# EAGLE design lisa_m (EAGLE 7.6.0)

## Sheet 1 of 2
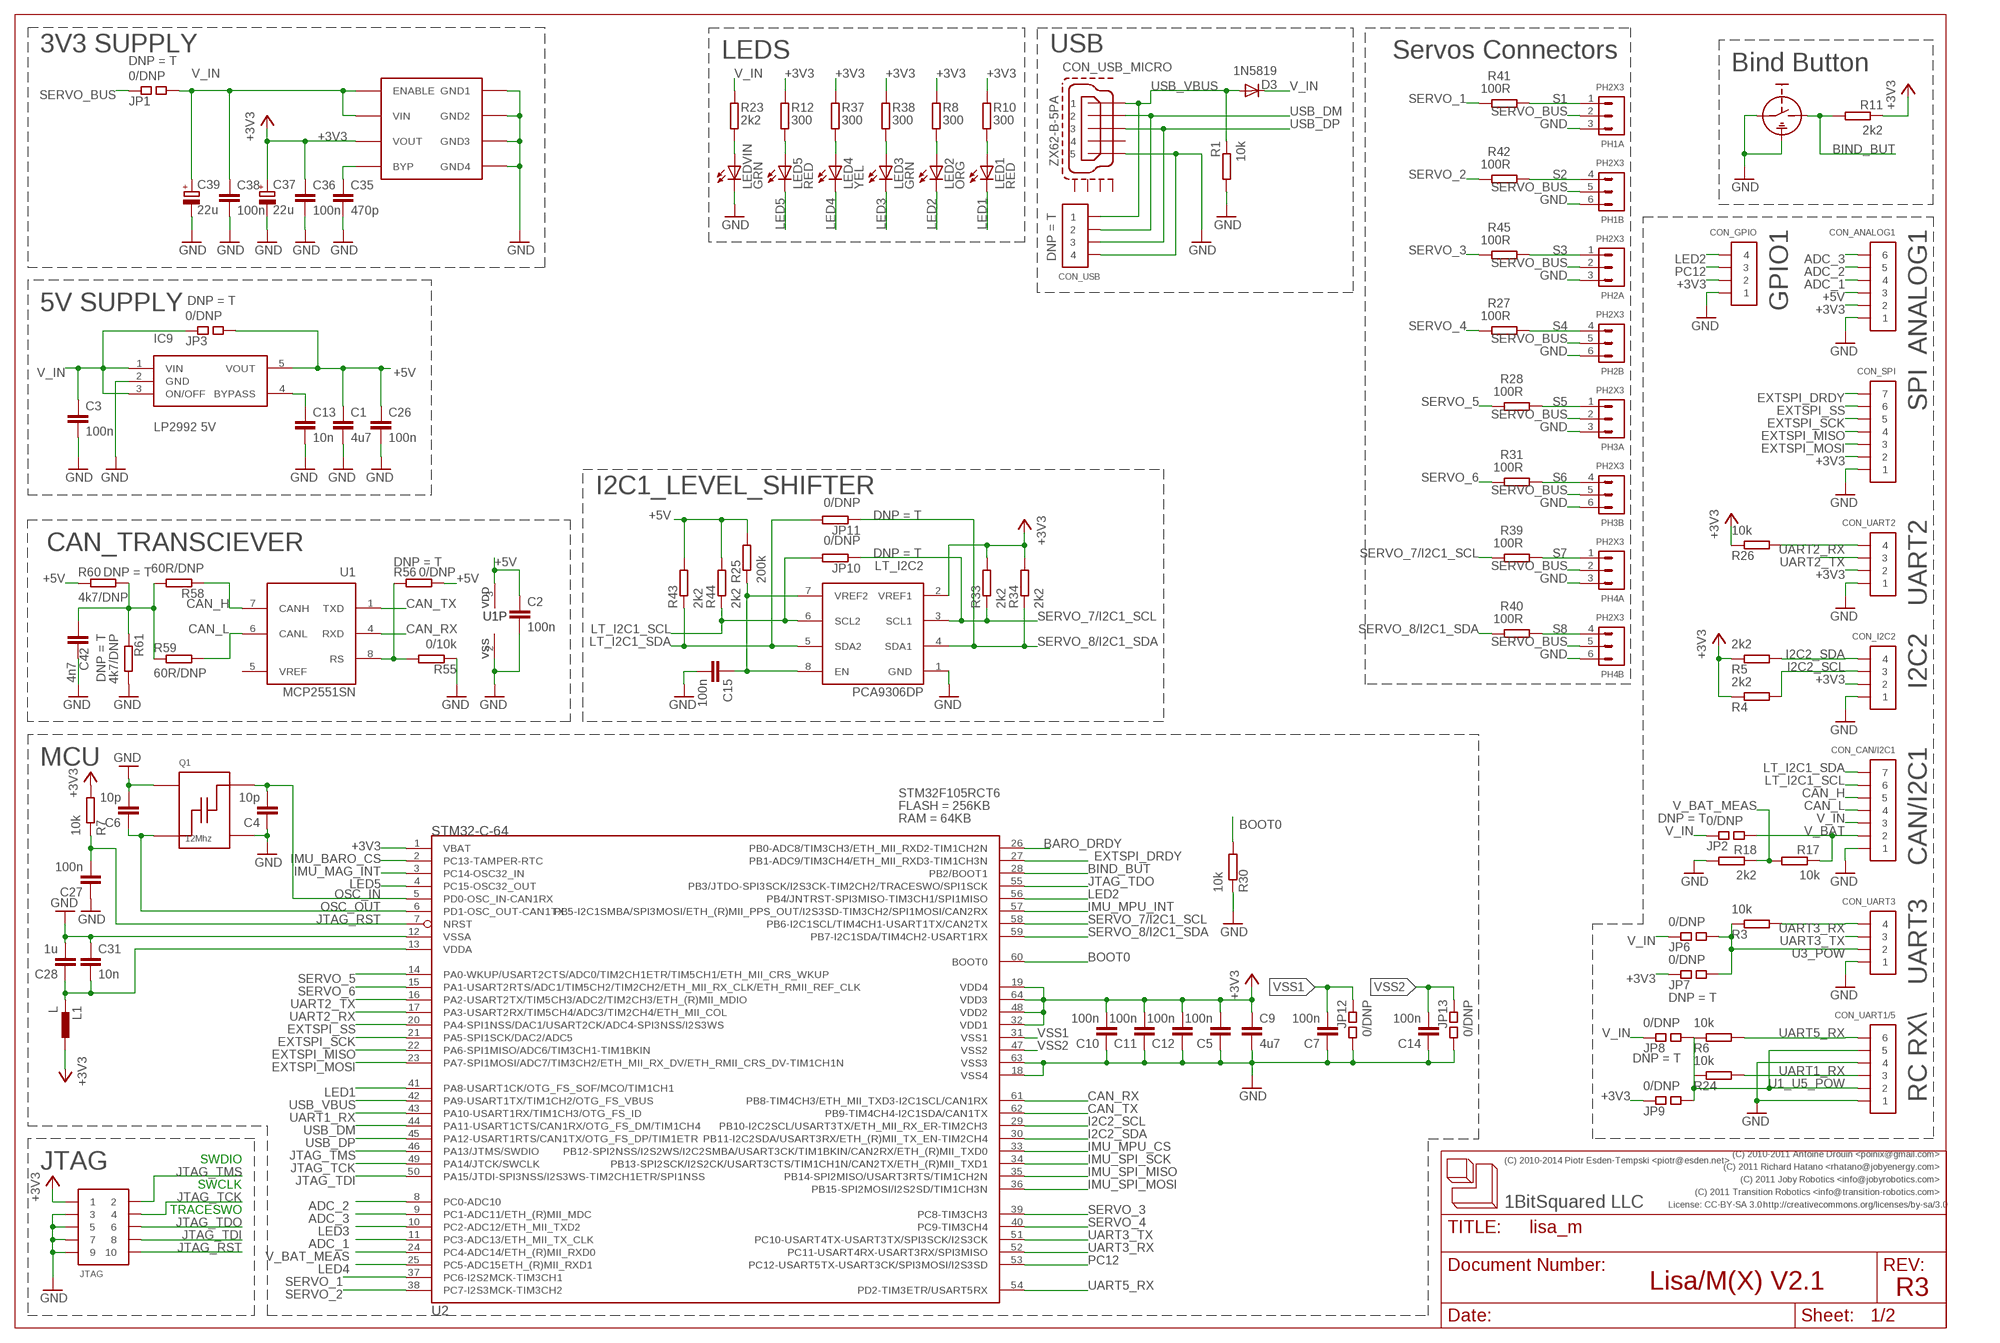
[diagram p0: schematic, sheet 1]

### Parts
C1  4u7  CAPACITOR-0603  [0603-CAP]
C2  100n  CAPACITOR-0402  [0402-CAP]
C3  100n  CAPACITOR-0402  [0402-CAP]
C4  10p  CAPACITOR-0402  [0402-CAP]
C5  100n  CAPACITOR-0402  [0402-CAP]
C6  10p  CAPACITOR-0402  [0402-CAP]
C7  100n  CAPACITOR-0402  [0402-CAP]
C9  4u7  CAPACITOR-0603  [0603-CAP]
C10  100n  CAPACITOR-0402  [0402-CAP]
C11  100n  CAPACITOR-0402  [0402-CAP]
C12  100n  CAPACITOR-0402  [0402-CAP]
C13  10n  CAPACITOR-0402  [0402-CAP]
C14  100n  CAPACITOR-0402  [0402-CAP]
C15  100n  CAPACITOR-0402  [0402-CAP]
C26  100n  CAPACITOR-0402  [0402-CAP]
C27  100n  CAPACITOR-0402  [0402-CAP]
C28  1u  CAPACITOR-0603  [0603-CAP]
C31  10n  CAPACITOR-0402  [0402-CAP]
C35  470p  CAPACITOR-0402  [0402-CAP]
C36  100n  CAPACITOR-0402  [0402-CAP]
C37  22u  CAPACITOR-POLB  [3528/B]
C38  100n  CAPACITOR-0402  [0402-CAP]
C39  22u  CAPACITOR-POLB  [3528/B]
C42  4n7  CAPACITOR-0603  [0603-CAP]
CON_ANALOG1  CONN_6-1-53398  [PB-53398-06]
CON_CAN/I2C1  CONN_7-1-53398  [PB-53398-07]
CON_GPIO  CONN_4-1-53398  [PB-53398-04]
CON_I2C2  CONN_4-1-53398  [PB-53398-04]
CON_SPI  CONN_7-1-53398  [PB-53398-07]
CON_UART1/5  CONN_6-1PB-53398-06_SMALL  [PB-53398-06]
CON_UART2  CONN_4-1-53398  [PB-53398-04]
CON_UART3  CONN_4-1-53398  [PB-53398-04]
CON_USB  CONN_4-1-53047  [PB-53047-04]
CON_USB_MICRO  ZX62-B-5PA  [ZX62-B-5PA]
D3  1N5819  DIODE-0603  [0603-DIO]
IC9  LP2992 5V  LP2992  [SOT23-5]
JP1  0/DNP  SQ_JMP-0402  [0402-SQJMP]
JP2  0/DNP  SQ_JMP-0402  [0402-SQJMP]
JP3  0/DNP  SQ_JMP-0402  [0402-SQJMP]
JP6  0/DNP  SQ_JMP-0402  [0402-SQJMP]
JP7  0/DNP  SQ_JMP-0402  [0402-SQJMP]
JP8  0/DNP  SQ_JMP-0402  [0402-SQJMP]
JP9  0/DNP  SQ_JMP-0402  [0402-SQJMP]
JP10  0/DNP  RESISTOR-0603  [0603-RES]
JP11  0/DNP  RESISTOR-0603  [0603-RES]
JP12  0/DNP  SQ_JMP-0402  [0402-SQJMP]
JP13  0/DNP  SQ_JMP-0402  [0402-SQJMP]
JTAG  PIN_HDR_EDG_1.27MM_5-2  CONN_5-2-FTSH-V  [FTSH-105-DV]
L1  L  INDUCTOR-0402  [0402-IND]
LED1  RED  LED-0402  [0402-LED]
LED2  ORG  LED-0402  [0402-LED]
LED3  GRN  LED-0402  [0402-LED]
LED4  YEL  LED-0402  [0402-LED]
LED5  RED  LED-0402  [0402-LED]
LEDVIN  GRN  LED-0402  [0402-LED]
LT_I2C2  PCA9306DP  [TSSOP_B3]
PH1  PH2X3  [PH010-2-3]
PH2  PH2X3  [PH010-2-3]
PH3  PH2X3  [PH010-2-3]
PH4  PH2X3  [PH010-2-3]
Q1  12Mhz  ABM8  [ABM8]
R1  10k  RESISTOR-0402  [0402-RES]
R3  10k  RESISTOR-0402  [0402-RES]
R4  2k2  RESISTOR-0402  [0402-RES]
R5  2k2  RESISTOR-0402  [0402-RES]
R6  10k  RESISTOR-0402  [0402-RES]
R7  10k  RESISTOR-0402  [0402-RES]
R8  300  RESISTOR-0402  [0402-RES]
R10  300  RESISTOR-0402  [0402-RES]
R11  2k2  RESISTOR-0402  [0402-RES]
R12  300  RESISTOR-0402  [0402-RES]
R17  10k  RESISTOR-0402  [0402-RES]
R18  2k2  RESISTOR-0402  [0402-RES]
R23  2k2  RESISTOR-0402  [0402-RES]
R24  10k  RESISTOR-0402  [0402-RES]
R25  200k  RESISTOR-0402  [0402-RES]
R26  10k  RESISTOR-0402  [0402-RES]
R27  100R  RESISTOR-0402  [0402-RES]
R28  100R  RESISTOR-0402  [0402-RES]
R30  10k  RESISTOR-0402  [0402-RES]
R31  100R  RESISTOR-0402  [0402-RES]
R33  2k2  RESISTOR-0402  [0402-RES]
R34  2k2  RESISTOR-0402  [0402-RES]
R37  300  RESISTOR-0402  [0402-RES]
R38  300  RESISTOR-0402  [0402-RES]
R39  100R  RESISTOR-0402  [0402-RES]
R40  100R  RESISTOR-0402  [0402-RES]
R41  100R  RESISTOR-0402  [0402-RES]
R42  100R  RESISTOR-0402  [0402-RES]
R43  2k2  RESISTOR-0402  [0402-RES]
R44  2k2  RESISTOR-0402  [0402-RES]
R45  100R  RESISTOR-0402  [0402-RES]
R55  0/10k  RESISTOR-0402  [0402-RES]
R56  0/DNP  RESISTOR-0402  [0402-RES]
R58  60R/DNP  RESISTOR-0402  [0402-RES]
R59  60R/DNP  RESISTOR-0402  [0402-RES]
R60  4k7/DNP  RESISTOR-0402  [0402-RES]
R61  4k7/DNP  RESISTOR-0402  [0402-RES]
SW1  MICROTACT_GND  [MICROTACT_GND]
U1  MCP2551SN  [SO-08]
U2  STM32-C-64  [LQFP64]
VREG1  MIC5209  [SOIC8]

### Nets
+3V3: C5.P$2 C9.P$1 C10.P$2 C11.P$2 C12.P$2 C36.P$1 C37.+ CON_ANALOG1.2 CON_GPIO.2 CON_I2C2.2 CON_SPI.2 CON_UART2.2 JP7.P$1 JP9.P$1 JTAG.1 L1.P$1 LT_I2C2.2(VREF1) R4.P$1 R5.P$1 R7.P$2 R8.P$2 R10.P$2 R11.P$1 R12.P$2 R26.P$1 R33.P$2 R34.P$2 R37.P$2 R38.P$2 U2.1(VBAT) U2.19(VDD4) U2.32(VDD1) U2.48(VDD2) U2.64(VDD3) VREG1.3(VOUT) ; also sheet 2
+5V: C1.P$1 C2.P$1 C26.P$1 CON_ANALOG1.3 IC9.5(VOUT) JP3.P$2 R25.P$2 R43.P$2 R44.P$2 R56.P$2 R60.P$1 U1.3(VDD)
ADC_1: CON_ANALOG1.4 U2.11(PC3-ADC13/ETH_MII_TX_CLK)
ADC_2: CON_ANALOG1.5 U2.8(PC0-ADC10)
ADC_3: CON_ANALOG1.6 U2.9(PC1-ADC11/ETH_(R)MII_MDC)
BARO_DRDY: U2.26(PB0-ADC8/TIM3CH3/ETH_MII_RXD2-TIM1CH2N)
BIND_BUT: R11.P$2 SW1.2 U2.28(PB2/BOOT1)
BOOT0: R30.P$2 U2.60(BOOT0)
CAN_CENTER: C42.P$2 R58.P$2 R59.P$1 R60.P$2 R61.P$1
CAN_H: CON_CAN/I2C1.5 R58.P$1 U1.7(CANH)
CAN_L: CON_CAN/I2C1.4 R59.P$2 U1.6(CANL)
CAN_RX: U1.4(RXD) U2.61(PB8-TIM4CH3/ETH_MII_TXD3-I2C1SCL/CAN1RX)
CAN_TX: U1.1(TXD) U2.62(PB9-TIM4CH4-I2C1SDA/CAN1TX)
EXTSPI_DRDY: CON_SPI.7 U2.27(PB1-ADC9/TIM3CH4/ETH_MII_RXD3-TIM1CH3N)
EXTSPI_MISO: CON_SPI.4 U2.22(PA6-SPI1MISO/ADC6/TIM3CH1-TIM1BKIN)
EXTSPI_MOSI: CON_SPI.3 U2.23(PA7-SPI1MOSI/ADC7/TIM3CH2/ETH_MII_RX_DV/ETH_RMII_CRS_DV-TIM1CH1N)
EXTSPI_SCK: CON_SPI.5 U2.21(PA5-SPI1SCK/DAC2/ADC5)
EXTSPI_SS: CON_SPI.6 U2.20(PA4-SPI1NSS/DAC1/USART2CK/ADC4-SPI3NSS/I2S3WS)
GND: C1.P$2 C2.P$2 C3.P$2 C4.P$1 C5.P$1 C6.P$2 C7.P$1 C9.P$2 C10.P$1 C11.P$1 C12.P$1 C13.P$2 C14.P$1 C15.P$2 C26.P$2 C27.P$1 C28.P$2 C31.P$1 C35.P$2 C36.P$2 C37.- C38.P$2 C39.- C42.P$1 CON_ANALOG1.1 CON_CAN/I2C1.1 CON_GPIO.1 CON_I2C2.1 CON_SPI.1 CON_UART1/5.1 CON_UART1/5.4 CON_UART2.1 CON_UART3.1 CON_USB.4 CON_USB_MICRO.PIN_5 IC9.2(GND) JP12.P$2 JP13.P$2 JTAG.3 JTAG.5 JTAG.7 JTAG.9 LEDVIN.C LT_I2C2.1(GND) PH1.3 PH1.6 PH2.3 PH2.6 PH3.3 PH3.6 PH4.3 PH4.6 Q1.P$2 Q1.P$4 R1.P$2 R18.P$2 R30.P$1 R55.P$1 R61.P$2 SW1.1 SW1.G(GND) U1.2(VSS) U2.12(VSSA) U2.18(VSS4) U2.63(VSS3) VREG1.5(GND4) VREG1.6(GND3) VREG1.7(GND2) VREG1.8(GND1) ; also sheet 2
I2C2_SCL: CON_I2C2.3 R4.P$2 U2.29(PB10-I2C2SCL/USART3TX/ETH_MII_RX_ER-TIM2CH3)
I2C2_SDA: CON_I2C2.4 R5.P$2 U2.30(PB11-I2C2SDA/USART3RX/ETH_(R)MII_TX_EN-TIM2CH4)
IMU_BARO_CS: U2.2(PC13-TAMPER-RTC) ; also sheet 2
IMU_MAG_INT: U2.3(PC14-OSC32_IN) ; also sheet 2
IMU_MPU_CS: U2.33(PB12-SPI2NSS/I2S2WS/I2C2SMBA/USART3CK/TIM1BKIN/CAN2RX/ETH_(R)MII_TXD0) ; also sheet 2
IMU_MPU_INT: U2.57(PB5-I2C1SMBA/SPI3MOSI/ETH_(R)MII_PPS_OUT/I2S3SD-TIM3CH2/SPI1MOSI/CAN2RX) ; also sheet 2
IMU_SPI_MISO: U2.35(PB14-SPI2MISO/USART3RTS/TIM1CH2N) ; also sheet 2
IMU_SPI_MOSI: U2.36(PB15-SPI2MOSI/I2S2SD/TIM1CH3N) ; also sheet 2
IMU_SPI_SCK: U2.34(PB13-SPI2SCK/I2S2CK/USART3CTS/TIM1CH1N/CAN2TX/ETH_(R)MII_TXD1) ; also sheet 2
JTAG_RST: C27.P$2 JTAG.10 R7.P$1 U2.7(NRST)
JTAG_TCK: JTAG.4 U2.49(PA14/JTCK/SWCLK)
JTAG_TDI: JTAG.8 U2.50(PA15/JTDI-SPI3NSS/I2S3WS-TIM2CH1ETR/SPI1NSS)
JTAG_TDO: JTAG.6 U2.55(PB3/JTDO-SPI3SCK/I2S3CK-TIM2CH2/TRACESWO/SPI1SCK)
JTAG_TMS: JTAG.2 U2.46(PA13/JTMS/SWDIO)
LED1: LED1.C U2.41(PA8-USART1CK/OTG_FS_SOF/MCO/TIM1CH1)
LED2: CON_GPIO.4 LED2.C U2.56(PB4/JNTRST-SPI3MISO-TIM3CH1/SPI1MISO)
LED3: LED3.C U2.10(PC2-ADC12/ETH_MII_TXD2)
LED4: LED4.C U2.25(PC5-ADC15ETH_(R)MII_RXD1)
LED5: LED5.C U2.4(PC15-OSC32_OUT)
LT_I2C1_SCL: CON_CAN/I2C1.6 JP10.P$2 LT_I2C2.6(SCL2) R44.P$1
LT_I2C1_SDA: CON_CAN/I2C1.7 JP11.P$2 LT_I2C2.5(SDA2) R43.P$1
N$1: R55.P$2 R56.P$1 U1.8(RS)
N$4: LED1.A R10.P$1
N$6: C13.P$1 IC9.4(BYPASS)
N$7: C35.P$1 VREG1.4(BYP)
N$8: C15.P$1 LT_I2C2.7(VREF2) LT_I2C2.8(EN) R25.P$1
N$10: LED2.A R8.P$1
N$12: LEDVIN.A R23.P$1
N$13: LED5.A R12.P$1
N$14: LED4.A R37.P$1
N$15: LED3.A R38.P$1
OSC_IN: C4.P$2 Q1.P$3 U2.5(PD0-OSC_IN-CAN1RX)
OSC_OUT: C6.P$1 Q1.P$1 U2.6(PD1-OSC_OUT-CAN1TX)
PC12: CON_GPIO.3 U2.53(PC12-USART5TX-USART3CK/SPI3MOSI/I2S3SD)
S1: PH1.1 R41.P$1
S2: PH1.4 R42.P$1
S3: PH2.1 R45.P$1
S4: PH2.4 R27.P$1
S5: PH3.1 R28.P$1
S6: PH3.4 R31.P$1
S7: PH4.1 R39.P$1
S8: PH4.4 R40.P$1
SERVO_1: R41.P$2 U2.37(PC6-I2S2MCK-TIM3CH1)
SERVO_2: R42.P$2 U2.38(PC7-I2S3MCK-TIM3CH2)
SERVO_3: R45.P$2 U2.39(PC8-TIM3CH3)
SERVO_4: R27.P$2 U2.40(PC9-TIM3CH4)
SERVO_5: R28.P$2 U2.14(PA0-WKUP/USART2CTS/ADC0/TIM2CH1ETR/TIM5CH1/ETH_MII_CRS_WKUP)
SERVO_6: R31.P$2 U2.15(PA1-USART2RTS/ADC1/TIM5CH2/TIM2CH2/ETH_MII_RX_CLK/ETH_RMII_REF_CLK)
SERVO_7/I2C1_SCL: JP10.P$1 LT_I2C2.3(SCL1) R33.P$1 R39.P$2 U2.58(PB6-I2C1SCL/TIM4CH1-USART1TX/CAN2TX)
SERVO_8/I2C1_SDA: JP11.P$1 LT_I2C2.4(SDA1) R34.P$1 R40.P$2 U2.59(PB7-I2C1SDA/TIM4CH2-USART1RX)
SERVO_BUS: JP1.P$1 PH1.2 PH1.5 PH2.2 PH2.5 PH3.2 PH3.5 PH4.2 PH4.5
U1_U5_POW: CON_UART1/5.2 CON_UART1/5.5 JP8.P$2 JP9.P$2 R6.P$1 R24.P$1
U3_POW: CON_UART3.2 JP6.P$2 JP7.P$2 R3.P$1
UART1_RX: CON_UART1/5.3 R24.P$2 U2.43(PA10-USART1RX/TIM1CH3/OTG_FS_ID)
UART2_RX: CON_UART2.4 R26.P$2 U2.17(PA3-USART2RX/TIM5CH4/ADC3/TIM2CH4/ETH_MII_COL)
UART2_TX: CON_UART2.3 U2.16(PA2-USART2TX/TIM5CH3/ADC2/TIM2CH3/ETH_(R)MII_MDIO)
UART3_RX: CON_UART3.4 R3.P$2 U2.52(PC11-USART4RX-USART3RX/SPI3MISO)
UART3_TX: CON_UART3.3 U2.51(PC10-USART4TX-USART3TX/SPI3SCK/I2S3CK)
UART5_RX: CON_UART1/5.6 R6.P$2 U2.54(PD2-TIM3ETR/USART5RX)
USB_DM: CON_USB.2 CON_USB_MICRO.PIN_2 U2.44(PA11-USART1CTS/CAN1RX/OTG_FS_DM/TIM1CH4)
USB_DP: CON_USB.3 CON_USB_MICRO.PIN_3 U2.45(PA12-USART1RTS/CAN1TX/OTG_FS_DP/TIM1ETR)
USB_VBUS: CON_USB.1 CON_USB_MICRO.PIN_1 D3.A R1.P$1 U2.42(PA9-USART1TX/TIM1CH2/OTG_FS_VBUS)
V_BAT: CON_CAN/I2C1.2 JP2.P$2 R17.P$1
V_BAT_MEAS: R17.P$2 R18.P$1 U2.24(PC4-ADC14/ETH_(R)MII_RXD0)
V_IN: C3.P$1 C38.P$1 C39.+ CON_CAN/I2C1.3 D3.C IC9.1(VIN) IC9.3(ON/OFF) JP1.P$2 JP2.P$1 JP3.P$1 JP6.P$1 JP8.P$1 R23.P$2 VREG1.1(ENABLE) VREG1.2(VIN) ; also sheet 2
VDDA: C28.P$1 C31.P$2 L1.P$2 U2.13(VDDA)
VSS1: C7.P$2 JP12.P$1 U2.31(VSS1)
VSS2: C14.P$2 JP13.P$1 U2.47(VSS2)
Unconnected: CON_USB_MICRO.GND_LEFT(S1) CON_USB_MICRO.GND_RIGHT(S2) CON_USB_MICRO.GND_UP_LEFT(S3) CON_USB_MICRO.GND_UP_RIGHT(S4) CON_USB_MICRO.PIN_4

### Notes on the sheet
- 3V3 SUPPLY | LEDS | USB | Servos Connectors
- Bind Button
- GPIO1 | ANALOG1
- 5V SUPPLY
- SPI
- I2C1_LEVEL_SHIFTER
- UART2
- CAN_TRANSCIEVER
- I2C2
- MCU | CAN/I2C1
- UART3
- RC RX\
- JTAG | (C) 2010-2011 Antoine Drouin <poinix@gmail.com>
- (C) 2010-2014 Piotr Esden-Tempski <piotr@esden.net>
- SWDIO | (C) 2011 Richard Hatano <rhatano@jobyenergy.com>
- (C) 2011 Joby Robotics <info@jobyrobotics.com>
- SWCLK | (C) 2011 Transition Robotics <info@transition-robotics.com>
- License: CC-BY-SA 3.0 | http://creativecommons.org/licenses/by-sa/3.0
- 1BitSquared LLC
- TRACESWO
- Lisa/M(X) V2.1 | R3

## Sheet 2 of 2
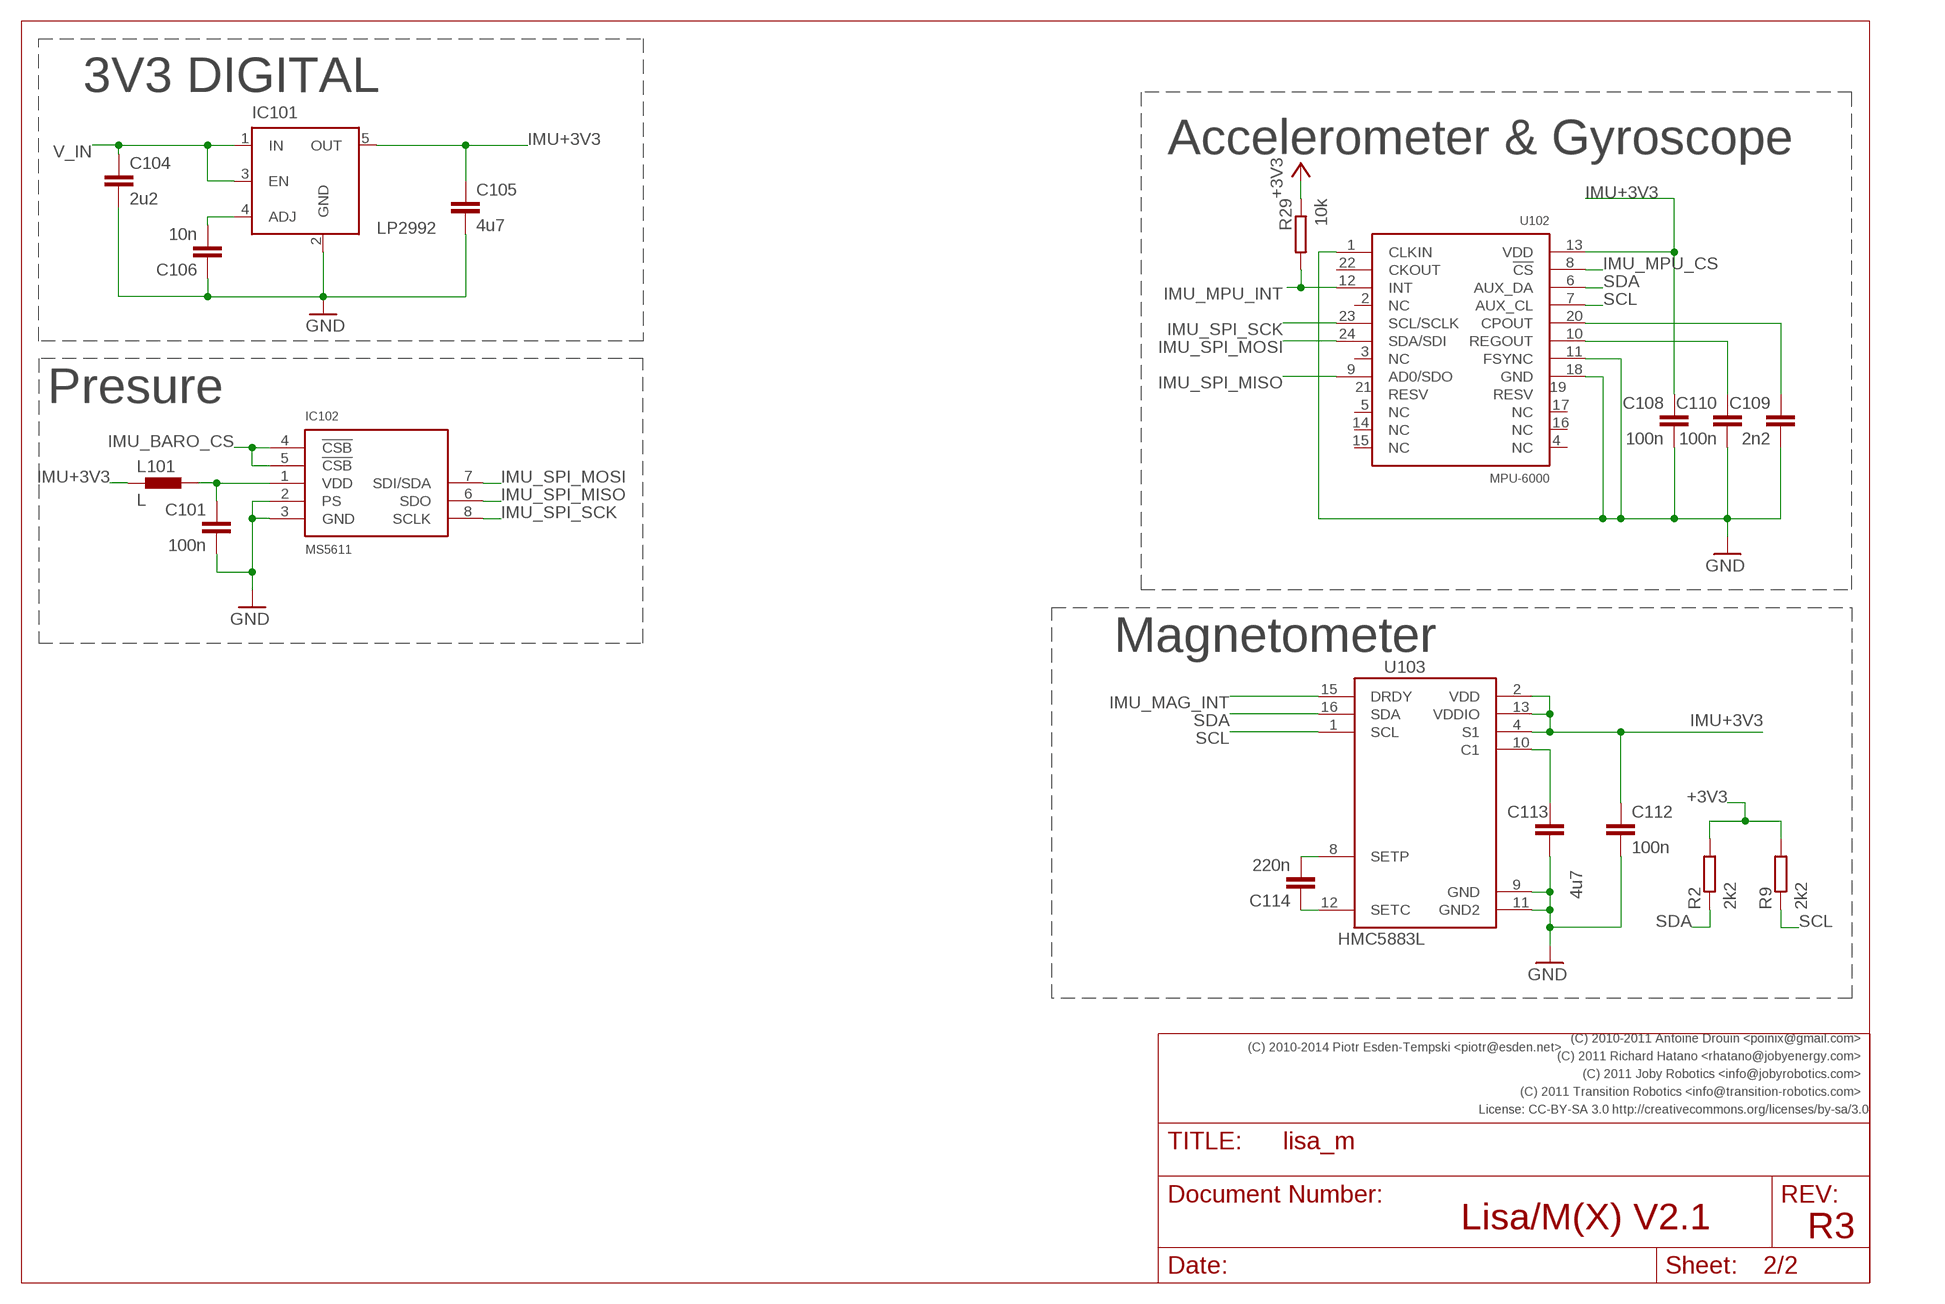
[diagram p1: schematic, sheet 2]

### Parts
C101  100n  CAPACITOR-0402  [0402-CAP]
C104  2u2  CAPACITOR-0603  [0603-CAP]
C105  4u7  CAPACITOR-0603  [0603-CAP]
C106  10n  CAPACITOR-0402  [0402-CAP]
C108  100n  CAPACITOR-0402  [0402-CAP]
C109  2n2  CAPACITOR-0402  [0402-CAP]
C110  100n  CAPACITOR-0402  [0402-CAP]
C112  100n  CAPACITOR-0402  [0402-CAP]
C113  4u7  CAPACITOR-0603  [0603-CAP]
C114  220n  CAPACITOR-0603  [0603-CAP]
IC101  LP2992  MIC5219BM5  [SOT23-5]
IC102  MS5611  [QFN-MS5611]
L101  L  INDUCTOR-0402  [0402-IND]
R2  2k2  RESISTOR-0402  [0402-RES]
R9  2k2  RESISTOR-0402  [0402-RES]
R29  10k  RESISTOR-0402  [0402-RES]
U102  MPU-6000  [QFN24-NO-PAD]
U103  HMC5883L  [LPCC16-HMC5883L]

### Nets
+3V3: R2.P$2 R9.P$2 R29.P$1 ; also sheet 1
BARO_+3V3: C101.P$1 IC102.1(VDD) L101.P$1
GND: C101.P$2 C104.P$2 C105.P$2 C106.P$1 C108.P$2 C109.P$2 C110.P$2 C112.P$2 C113.P$2 IC101.2(GND) IC102.2(PS) IC102.3(GND) U102.1(CLKIN) U102.11(FSYNC) U102.18(GND) U103.9(GND) U103.11(GND2) ; also sheet 1
IMU+3V3: C105.P$1 C108.P$1 C112.P$1 IC101.5(OUT) L101.P$2 U102.13(VDD) U103.2(VDD) U103.4(S1) U103.13(VDDIO)
IMU_BARO_CS: IC102.4(!CSB) IC102.5(!CSB) ; also sheet 1
IMU_MAG_INT: U103.15(DRDY) ; also sheet 1
IMU_MPU_CS: U102.8(!CS) ; also sheet 1
IMU_MPU_INT: R29.P$2 U102.12(INT) ; also sheet 1
IMU_SPI_MISO: IC102.6(SDO) U102.9(AD0/SDO) ; also sheet 1
IMU_SPI_MOSI: IC102.7(SDI/SDA) U102.24(SDA/SDI) ; also sheet 1
IMU_SPI_SCK: IC102.8(SCLK) U102.23(SCL/SCLK) ; also sheet 1
N$2: C109.P$1 U102.20(CPOUT)
N$3: C110.P$1 U102.10(REGOUT)
N$5: C113.P$1 U103.10(C1)
N$19: C106.P$2 IC101.4(ADJ)
N$34: C114.P$2 U103.8(SETP)
N$48: C114.P$1 U103.12(SETC)
SCL: R9.P$1 U102.7(AUX_CL) U103.1(SCL)
SDA: R2.P$1 U102.6(AUX_DA) U103.16(SDA)
V_IN: C104.P$1 IC101.1(IN) IC101.3(EN) ; also sheet 1
Unconnected: U102.2(NC) U102.3(NC) U102.4(NC) U102.5(NC) U102.14(NC) U102.15(NC) U102.16(NC) U102.17(NC) U102.19(RESV) U102.21(RESV) U102.22(CKOUT)

### Notes on the sheet
- 3V3 DIGITAL
- Accelerometer & Gyroscope
- Presure
- Magnetometer
- (C) 2010-2011 Antoine Drouin <poinix@gmail.com>
- (C) 2010-2014 Piotr Esden-Tempski <piotr@esden.net>
- (C) 2011 Richard Hatano <rhatano@jobyenergy.com>
- (C) 2011 Joby Robotics <info@jobyrobotics.com>
- (C) 2011 Transition Robotics <info@transition-robotics.com>
- License: CC-BY-SA 3.0 | http://creativecommons.org/licenses/by-sa/3.0
- Lisa/M(X) V2.1 | R3

## Power pins joined to a net without a drawn wire
VREF: U1.5(VREF)

## Library data of the parts
C1 C9 C105 C113 = pel_dipol_comp:CAPACITOR; PARTNO: cap-cer-0603-4u7
C2 C3 C5 C7 C10-C12 C14 C15 C26 C27 C36 C38 C101 C108 C110 C112 = pel_dipol_comp:CAPACITOR; PARTNO: cap-cer-0402-100n
C4 C6 = pel_dipol_comp:CAPACITOR; PARTNO: cap-cer-0402-10p
C13 C31 C106 = pel_dipol_comp:CAPACITOR; PARTNO: cap-cer-0402-10n
C28 = pel_dipol_comp:CAPACITOR; PARTNO: cap-cer-0603-1u
C35 = pel_dipol_comp:CAPACITOR; PARTNO: cap-cer-0402-470p
C37 C39 = pel_dipol_comp:CAPACITOR-POL; PARTNO: cap-tan-B-22u-16v
C42 = pel_dipol_comp:CAPACITOR; PARTNO: cap-cer-0603-4n7
C104 = pel_dipol_comp:CAPACITOR; PARTNO: cap-cer-0603-2u2
C109 = pel_dipol_comp:CAPACITOR; PARTNO: cap-cer-0402-2n2
C114 = pel_dipol_comp:CAPACITOR; PARTNO: cap-cer-0603-220n
CON_ANALOG1 = pel_molex:CONN_6-1; PARTNO: conn-picoblade-smd-0.05in-6-vert
CON_CAN/I2C1 CON_SPI = pel_molex:CONN_7-1; PARTNO: conn-picoblade-smd-0.05in-7-vert
CON_GPIO CON_I2C2 CON_UART2 CON_UART3 = pel_molex:CONN_4-1; PARTNO: conn-picoblade-smd-0.05in-4-vert
CON_UART1/5 = joby_robotics:CONN_6-1: molex con with reduced size landing pads to allow routing 6 mil tracks between them; PARTNO: conn-picoblade-smd-0.05in-6-vert
CON_USB = pel_molex:CONN_4-1; DNP: T; PARTNO: conn-picoblade-th-0.05in-4-vert
CON_USB_MICRO = open-bldc:ZX62-B-5PA; PARTNO: conn-smd-usb-micro-b
D3 = pel_dipol_comp:DIODE; PARTNO: diode-schottky-0603
IC9 = open-bldc:LP2992; PARTNO: vreg-sot-23-5-5v
IC101 = v-reg-micrel:MIC5219BM5: VOLTAGE REGULATOR; PARTNO: vreg-sot23-5-3v3
IC102 = aspirin:MS5611; PARTNO: ic-sensr-ms5611
JP1-JP3 JP7 JP8 = pel_jumpers:SQ_JMP; DNP: T; PARTNO: res-0402-0
JP6 JP9 JP12 JP13 = pel_jumpers:SQ_JMP; PARTNO: res-0402-0
JP10 JP11 = pel_dipol_comp:RESISTOR; DNP: T; PARTNO: res-0603-0
JTAG = pel_misc:CONN_5-2; PARTNO: conn-smd-0.05in-5-2
L1 L101 = pel_dipol_comp:INDUCTOR; PARTNO: ferrite-0402-600
LED1 = pel_dipol_comp:LED; PARTNO: led-0402-red
LED2 = pel_dipol_comp:LED; PARTNO: led-0402-org
LED3 LED5 LEDVIN = pel_dipol_comp:LED; PARTNO: led-0402-grn
LED4 = pel_dipol_comp:LED; PARTNO: led-0402-yel
LT_I2C2 = booz:PCA9306: Dual bidirectional I2C-bus and SMBus voltage-level translator; PARTNO: ic-tssop8-level-trans
PH1-PH4 = pel_hdr:PH2X3
Q1 = booz:ABM8; PARTNO: xtal-abm8-12mhz
R1 R3 R6 R7 R17 R24 R26 R29 R30 R55 = pel_dipol_comp:RESISTOR; PARTNO: res-0402-10k
R2 R4 R5 R9 R11 R18 R23 R33 R34 R43 R44 = pel_dipol_comp:RESISTOR; PARTNO: res-0402-2k2
R8 R10 R12 R37 R38 = pel_dipol_comp:RESISTOR; PARTNO: res-0402-300
R25 = pel_dipol_comp:RESISTOR; PARTNO: res-0402-200k
R27 R28 R31 R39-R42 R45 = pel_dipol_comp:RESISTOR; PARTNO: res-0402-100
R56 = pel_dipol_comp:RESISTOR; DNP: T; PARTNO: res-0402-0
R58 R59 = pel_dipol_comp:RESISTOR; PARTNO: res-0402-60.4
R60 R61 = pel_dipol_comp:RESISTOR; DNP: T; PARTNO: res-0402-4k7
SW1 = paparazzi:MICROTACT_GND; PARTNO: sw-tact-top-gnd-3.0-2.5
U1 = microchip_can:MCP2551: High Speed CAN tranceiver; PARTNO: ic-so8-can
U2 = pel_stm32:STM32-C-64; FLASH: 256KB; PARTNO: ic-mcu-stm32f415rgt6; PART_NR: STM32F105RCT6; RAM: 64KB
U102 = aspirin:MPU-6000; PARTNO: ic-sensr-mpu6000
U103 = aspirin:HMC5883L; PARTNO: ic-sensr-hmc5883l
VREG1 = paparazzi:MIC5209; PARTNO: vreg-so8-3v3

## Net classes
0 default: width 0.15 mm, drill 0.3 mm, clearance 0.15 mm

## Board
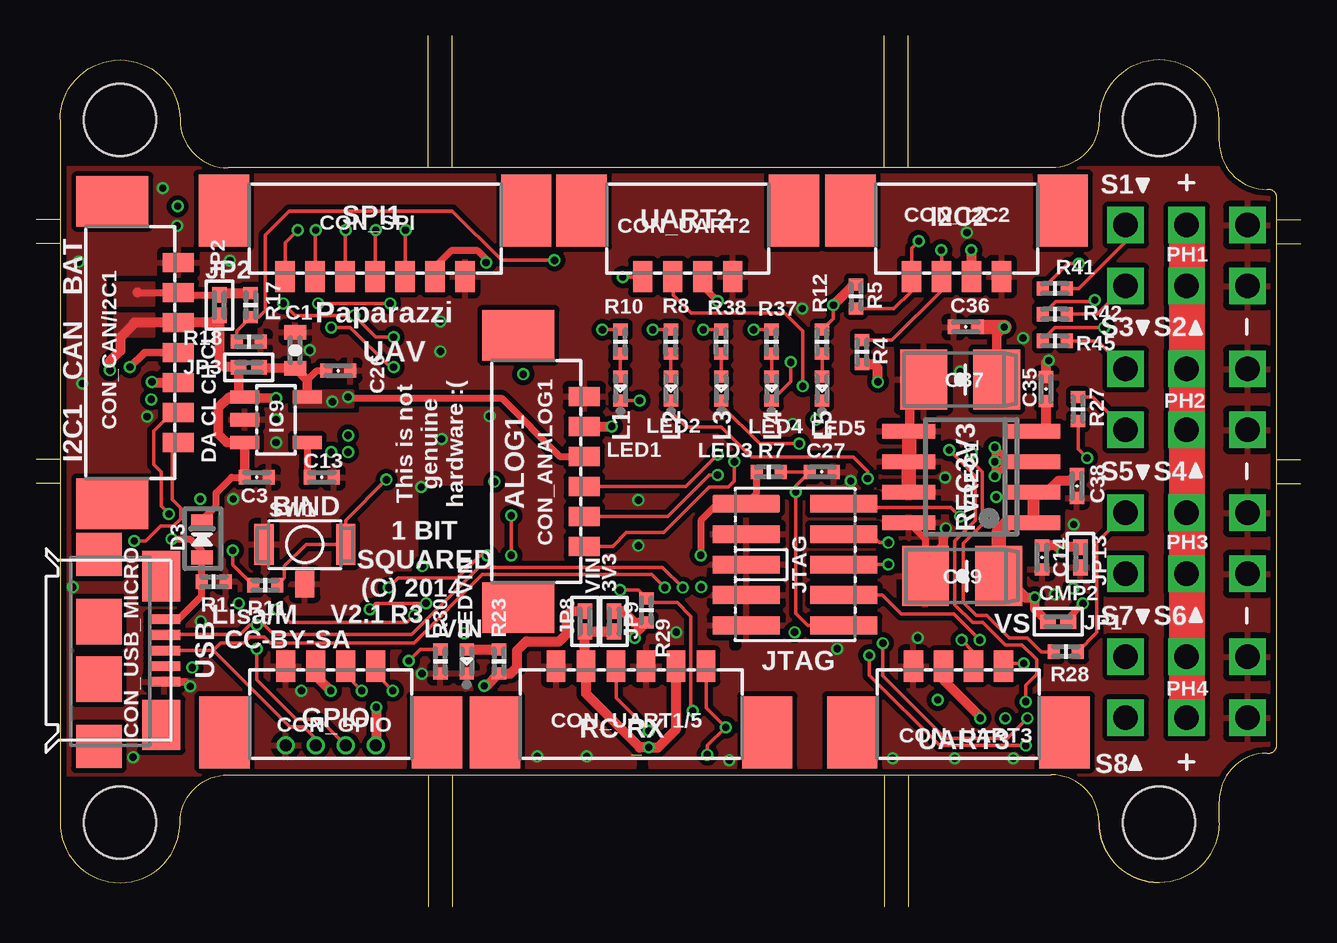
[diagram p2: board, top side]
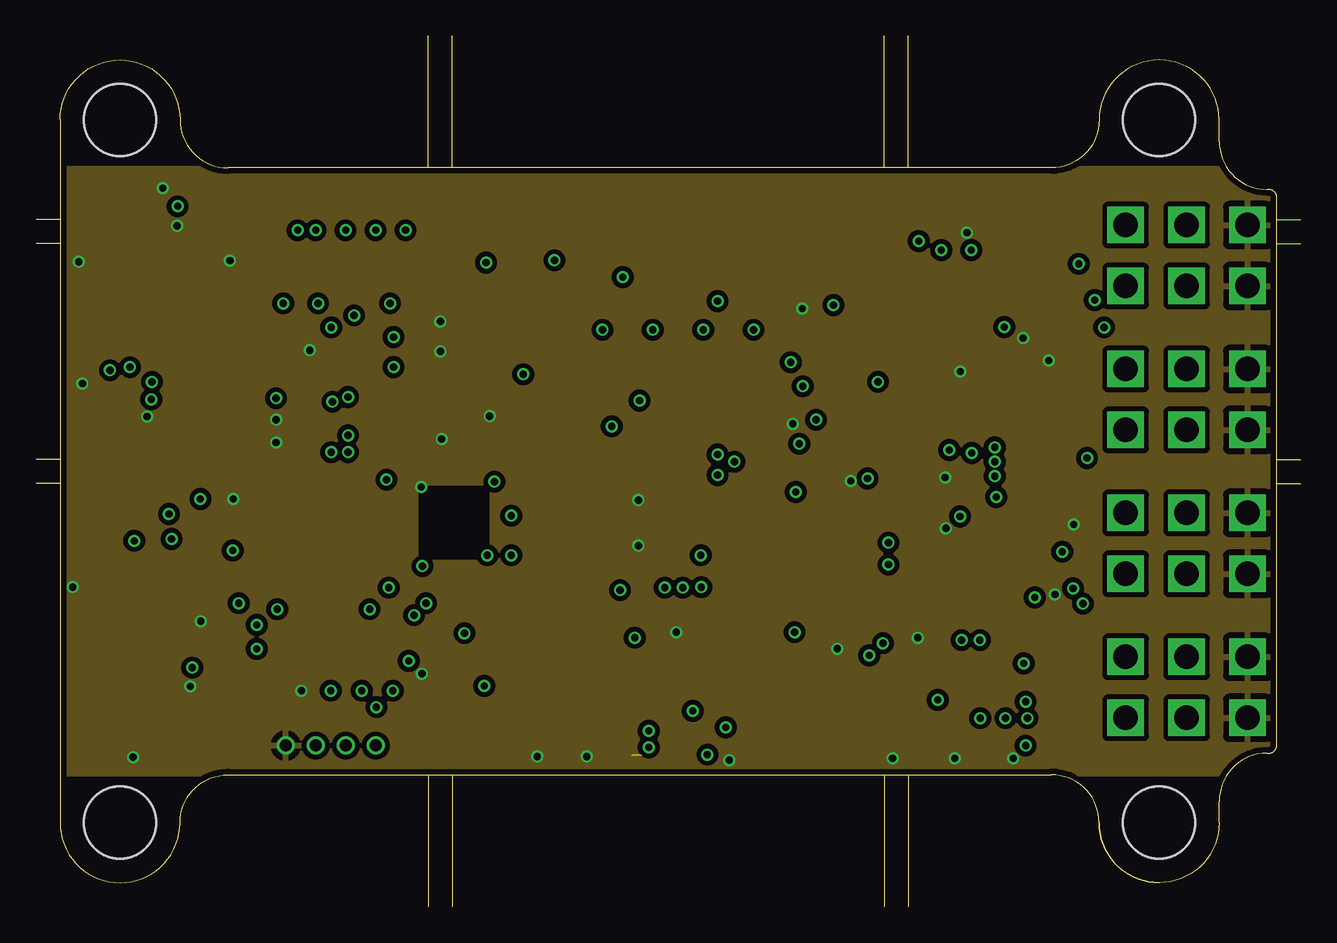
[diagram p3: board, inner layer Route2]
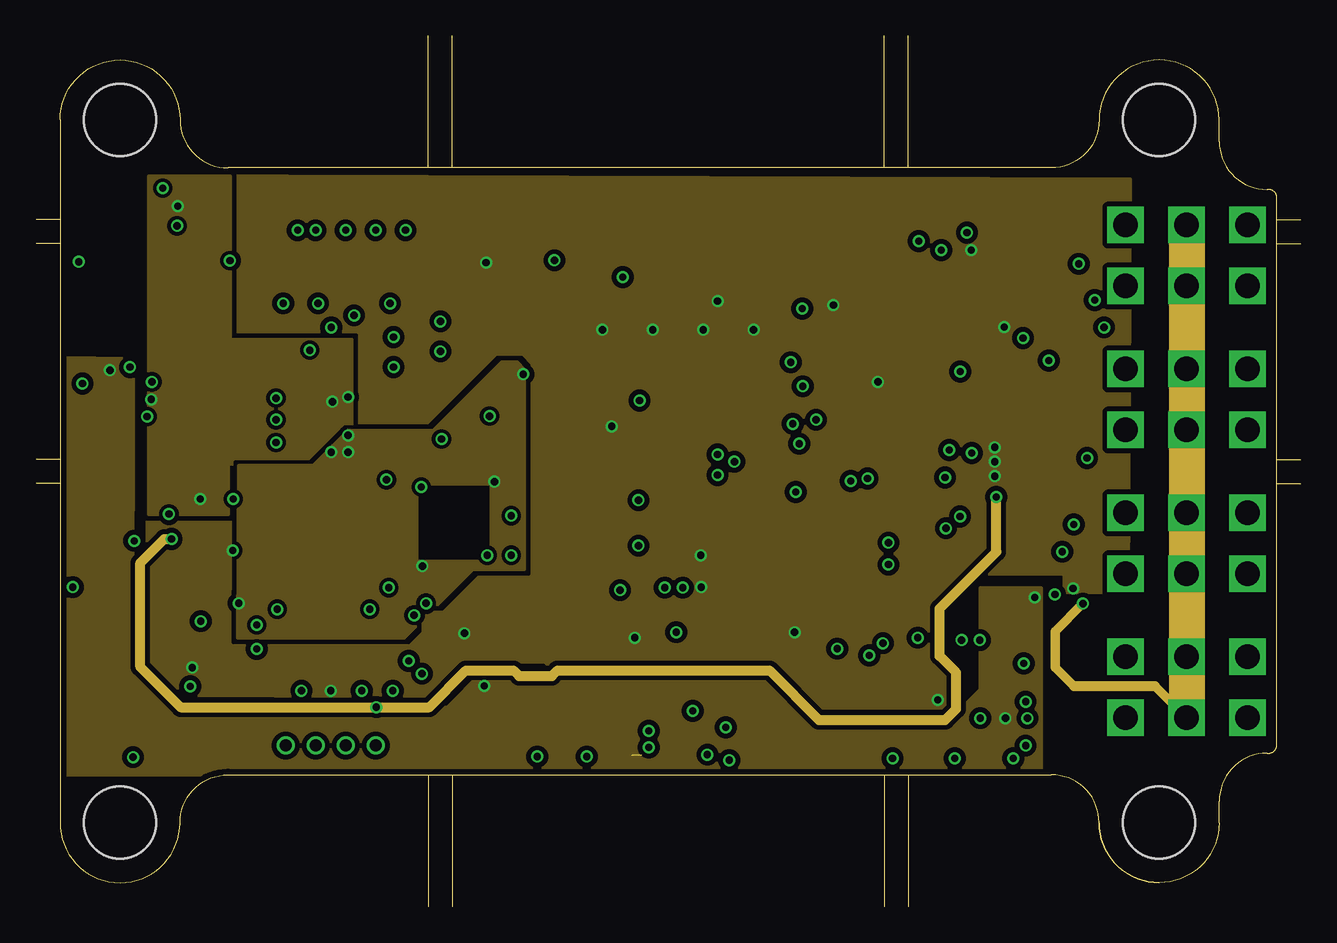
[diagram p4: board, inner layer Route15]
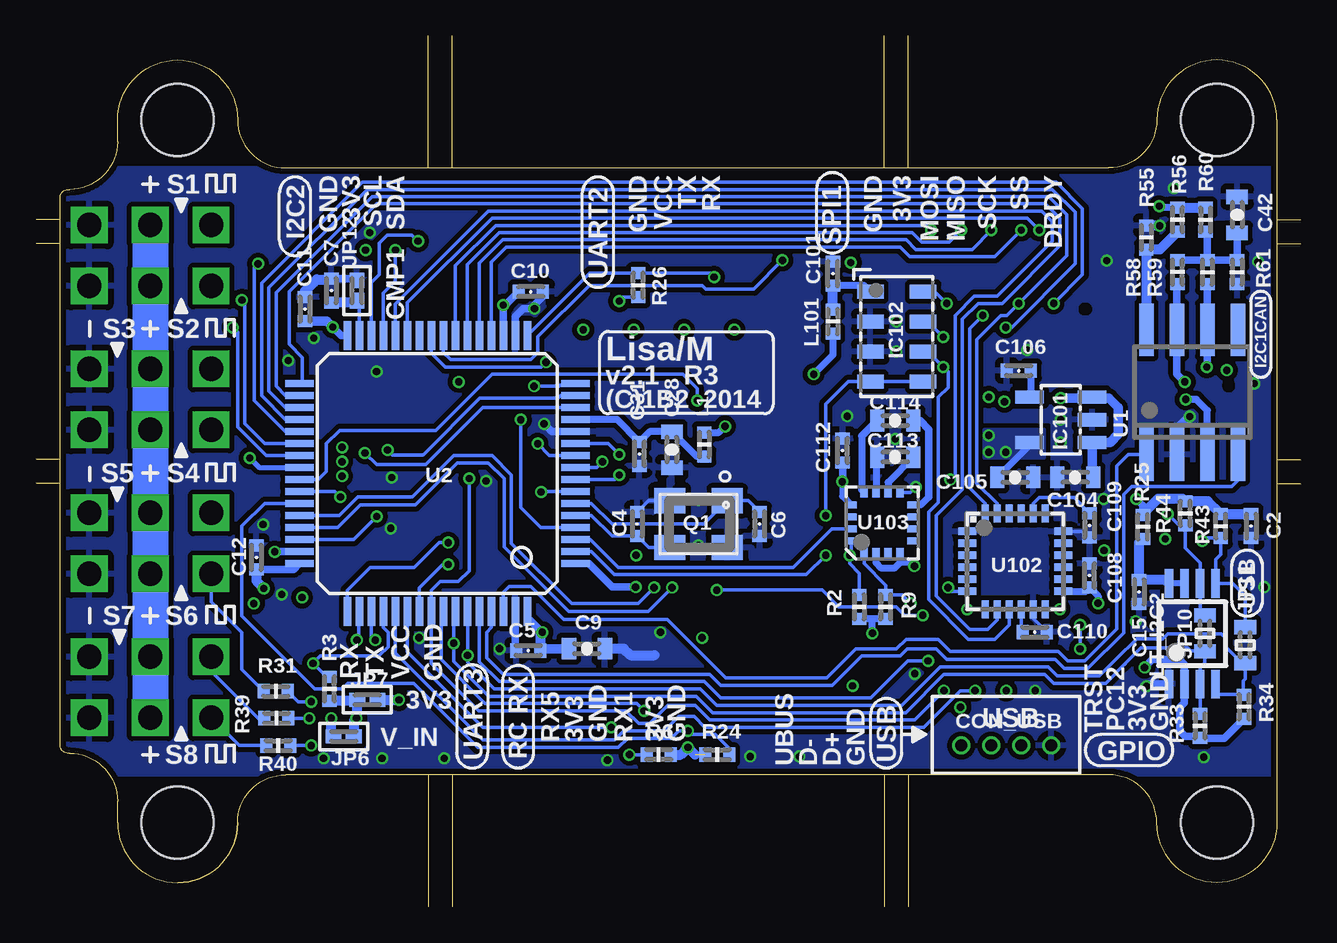
[diagram p5: board, bottom side, seen from below]

Size 50.7 x 34.3 mm. Coordinates in mm from the lower left corner, seen from the top.
Outline: 7,4.5 41.3,4.5 arc-90 43.3,2.5 arc90 45.8,0 arc90 48.3,2.5 48.3,3.4 arc-90 50.3,5.4 arc90 50.7,5.7 50.7,28.6 arc90 50.3,28.9 arc-90 48.3,30.9 48.3,31.8 arc90 45.8,34.3 arc90 43.3,31.8 arc-90 41.3,29.8 7,29.8 arc-90 5,31.8 arc90 2.5,34.3 arc90 0,31.8 0,2.5 arc90 2.5,0 arc90 5,2.5 arc-90 7,4.5
Copper layers (1*2+15*16): Top 0.035mm / dielectric 0.2mm / Route2 0.035mm / dielectric 1.5mm / Route15 0.035mm / dielectric 0.2mm / Bottom 0.035mm
Design rules "default": minimum track width 0.15mm, minimum drill 0.3mm, track to track 0.15mm, track to pad 0.15mm, pad to pad 0.15mm, via to via 0.15mm, smd to smd 0.15mm, copper to edge 10mil, drill to drill 8mil, minimum pad ring 0.1mm, minimum via ring 0.1mm, stop-mask expansion 14mil, vias tented up to drill 0.31mm, thermal gap 10mil
Holes 3 mm at 2.5,2.5 2.5,31.8 45.8,31.8 45.8,2.5
tKeepout: area 0.5,0.5 to 4.5,4.5; area 43.8,0.5 to 47.8,4.5; area 0.5,29.8 to 4.5,33.8; area 43.8,29.8 to 47.8,33.8
tRestrict: area 41.6,15.5 to 41.7,15.8; area 39.5,15.5 to 39.6,15.8; area 40.3,20.6 to 40.6,20.7; area 40.8,13.5 to 41.1,13.6; area 35.8,18.2 to 36.1,18.2; area 28.1,9.9 to 28.2,10.1; area 24.2,4.8 to 24.3,5.2
bRestrict: area 2.3,27.3 to 2.5,27.4; area 2,20.7 to 2.1,20.8; area 2.2,24.9 to 2.3,25; area 7.9,23.9 to 8.1,24; area 3.5,17.2 to 3.6,17.3; area 4.8,17.2 to 4.9,17.3; area 0.4,14.8 to 0.5,14.9; area 5.1,10.8 to 5.2,11; area 30.5,25.1 to 30.7,25.2; area 31.3,10.3 to 31.4,10.4; area 28.3,9.7 to 28.4,9.8
Milling: 46 lines

### Footprints (pad centres in the part's own frame; a part is rotated, then mirrored left to right if it is on the bottom)
0603-CAP = smd 0.6 x 0.9: P$1 -0.75,0; P$2 0.75,0
0402-CAP = smd 0.5 x 0.6: P$1 -0.5,0; P$2 0.5,0
3528/B = smd 1.95 x 2.5: + -1.525,0; - 1.525,0
PB-53398-06 = smd 0.8 x 1.3: 1 -3.125,1.25; 2 -1.875,1.25; 3 -0.625,1.25; 4 0.625,1.25; 5 1.875,1.25; 6 3.125,1.25 | smd 2.1 x 3: PAD1 -5.675,-1.5; PAD2 5.675,-1.5
PB-53398-07 = smd 0.8 x 1.3: 1 -3.75,1.25; 2 -2.5,1.25; 3 -1.25,1.25; 4 0,1.25; 5 1.25,1.25; 6 2.5,1.25; 7 3.75,1.25 | smd 2.1 x 3: PAD1 -6.3,-1.5; PAD2 6.3,-1.5
PB-53398-04 = smd 0.8 x 1.3: 1 -1.875,1.25; 2 -0.625,1.25; 3 0.625,1.25; 4 1.875,1.25 | smd 2.1 x 3: PAD1 -4.425,-1.5; PAD2 4.425,-1.5
PB-53398-06' = smd 0.775 x 1.3: 1 -3.125,1.25; 2 -1.875,1.25; 3 -0.625,1.25; 4 0.625,1.25; 5 1.875,1.25; 6 3.125,1.25 | smd 2.1 x 3: PAD1 -5.675,-1.5; PAD2 5.675,-1.5
PB-53047-04 = drill 0.5: 1 -1.875,0; 2 -0.625,0; 3 0.625,0; 4 1.875,0
ZX62-B-5PA = smd 1.8 x 1.9: GND_LEFT -4,0; GND_RIGHT 4,0 | smd 1.9 x 1.9: GND_MID_LEFT -1.2,0; GND_MID_RIGHT 1.2,0 | smd 2.1 x 1.6: GND_UP_LEFT -3.1,2.6; GND_UP_RIGHT 3.1,2.6 | smd 0.4 x 1.35: PIN_1 -1.3,2.725; PIN_2 -0.65,2.725; PIN_3 0,2.725; PIN_4 0.65,2.725; PIN_5 1.3,2.725
0603-DIO = smd 0.6 x 0.9: A 0.75,0; C -0.75,0
SOT23-5 = smd 0.55 x 1.2: 1 -0.95,-1.3; 2 0,-1.3; 3 0.95,-1.3; 4 0.95,1.3; 5 -0.95,1.3
QFN-MS5611 = smd 1.1 x 0.6: 1 -1.1,1.875; 2 -1.1,0.625; 3 -1.1,-0.625; 4 -1.1,-1.875; 5 1.1,-1.875; 6 1.1,-0.625; 7 1.1,0.625; 8 1.1,1.875
0402-SQJMP = smd 0.652 x 0.6: P$1 -0.424,0; P$2 0.424,0
0603-RES = smd 0.6 x 0.9: P$1 -0.75,0; P$2 0.75,0
FTSH-105-DV = smd 0.74 x 2.8: 1 -2.54,-2.03; 2 -2.54,2.03; 3 -1.27,-2.03; 4 -1.27,2.03; 5 0,-2.03; 6 0,2.03; 7 1.27,-2.03; 8 1.27,2.03; 9 2.54,-2.03; 10 2.54,2.03
0402-IND = smd 0.5 x 0.6: P$1 -0.5,0; P$2 0.5,0
0402-LED = smd 0.5 x 0.6: A -0.5,0; C 0.5,0
TSSOP_B3 = smd 1.2 x 0.35: 1 -2.925,0.975; 2 -2.925,0.325; 3 -2.925,-0.325; 4 -2.925,-0.975; 5 1.275,-0.975; 6 1.275,-0.325; 7 1.275,0.325; 8 1.275,0.975
PH010-2-3 = drill 1.016 square: 1 0,0; 2 2.54,0; 3 5.08,0; 4 0,-2.54; 5 2.54,-2.54; 6 5.08,-2.54
ABM8 = smd 1.3 x 1.05: P$1 -1.2,-0.975; P$2 1.2,-0.975; P$3 1.2,0.975; P$4 -1.2,0.975
0402-RES = smd 0.5 x 0.6: P$1 -0.5,0; P$2 0.5,0
MICROTACT_GND = smd 0.8 x 1.7: 1 -1.7,0; 2 1.7,0 | smd 0.8 x 1.1: G 0,-1.65
SO-08 = smd 0.6 x 2.2: 1 -1.905,-2.6; 2 -0.635,-2.6; 3 0.635,-2.6; 4 1.905,-2.6; 5 1.905,2.6; 6 0.635,2.6; 7 -0.635,2.6; 8 -1.905,2.6
LQFP64 = smd 1.2 x 0.3: 1 -5.75,3.75; 2 -5.75,3.25; 3 -5.75,2.75; 4 -5.75,2.25; 5 -5.75,1.75; 6 -5.75,1.25; 7 -5.75,0.75; 8 -5.75,0.25; 9 -5.75,-0.25; 10 -5.75,-0.75; 11 -5.75,-1.25; 12 -5.75,-1.75; 13 -5.75,-2.25; 14 -5.75,-2.75; 15 -5.75,-3.25; 16 -5.75,-3.75; 33 5.75,-3.75; 34 5.75,-3.25; 35 5.75,-2.75; 36 5.75,-2.25; 37 5.75,-1.75; 38 5.75,-1.25; 39 5.75,-0.75; 40 5.75,-0.25; 41 5.75,0.25; 42 5.75,0.75; 43 5.75,1.25; 44 5.75,1.75; 45 5.75,2.25; 46 5.75,2.75; 47 5.75,3.25; 48 5.75,3.75 | smd 0.3 x 1.2: 17 -3.75,-5.75; 18 -3.25,-5.75; 19 -2.75,-5.75; 20 -2.25,-5.75; 21 -1.75,-5.75; 22 -1.25,-5.75; 23 -0.75,-5.75; 24 -0.25,-5.75; 25 0.25,-5.75; 26 0.75,-5.75; 27 1.25,-5.75; 28 1.75,-5.75; 29 2.25,-5.75; 30 2.75,-5.75; 31 3.25,-5.75; 32 3.75,-5.75; 49 3.75,5.75; 50 3.25,5.75; 51 2.75,5.75; 52 2.25,5.75; 53 1.75,5.75; 54 1.25,5.75; 55 0.75,5.75; 56 0.25,5.75; 57 -0.25,5.75; 58 -0.75,5.75; 59 -1.25,5.75; 60 -1.75,5.75; 61 -2.25,5.75; 62 -2.75,5.75; 63 -3.25,5.75; 64 -3.75,5.75
QFN24-NO-PAD = smd 0.75 x 0.3: 1 -2,1.25; 2 -2,0.75; 3 -2,0.25; 4 -2,-0.25; 5 -2,-0.75; 6 -2,-1.25; 13 2,-1.25; 14 2,-0.75; 15 2,-0.25; 16 2,0.25; 17 2,0.75; 18 2,1.25 | smd 0.3 x 0.75: 7 -1.25,-2; 8 -0.75,-2; 9 -0.25,-2; 10 0.25,-2; 11 0.75,-2; 12 1.25,-2; 19 1.25,2; 20 0.75,2; 21 0.25,2; 22 -0.25,2; 23 -0.75,2; 24 -1.25,2
LPCC16-HMC5883L = smd 0.45 x 0.3: 1 -1.275,0.75; 2 -1.275,0.25; 3 -1.275,-0.25; 4 -1.275,-0.75; 9 1.275,-0.75; 10 1.275,-0.25; 11 1.275,0.25; 12 1.275,0.75 | smd 0.3 x 0.45: 5 -0.75,-1.275; 6 -0.25,-1.275; 7 0.25,-1.275; 8 0.75,-1.275; 13 0.75,1.275; 14 0.25,1.275; 15 -0.25,1.275; 16 -0.75,1.275
SOIC8 = smd 0.6 x 2.2: 1 -1.905,-2.6; 2 -0.635,-2.6; 3 0.635,-2.6; 4 1.905,-2.6; 5 1.905,2.6; 6 0.635,2.6; 7 -0.635,2.6; 8 -1.905,2.6

### Placement (x,y rotation side)
C1  9.8,22.2 90 top
C2  1.07,14.86 270 bottom
C3  8.2,16.9 0 top
C4  26.65,14.95 270 bottom
C5  31.19,9.68 0 bottom
C6  21.55,14.95 270 bottom
C7  39.4,24.69 270 bottom
C9  28.75,9.76 0 bottom
C10  31.08,24.64 180 bottom
C11  40.49,23.91 270 bottom
C12  42.52,13.57 270 bottom
C13  10.9,16.9 0 top
C14  40.92,13.57 90 top
C15  5.73,12.12 270 bottom
C26  11.6,21.35 0 top
C27  31.74,17.12 180 top
C28  25.21,18.06 270 bottom
C31  26.55,17.88 90 bottom
C35  41.09,20.58 90 top
C36  37.74,23.17 180 top
C37  37.51,20.98 180 top
C38  42.37,16.54 270 top
C39  37.59,12.78 180 top
C42  1.65,27.85 270 bottom
C101  18.5,25.4 90 bottom
C104  8.4,16.9 180 bottom
C105  10.9,16.9 0 bottom
C106  10.75,21.35 0 bottom
C108  7.8,12.8 90 bottom
C109  7.8,14.9 270 bottom
C110  10.08,10.45 0 bottom
C112  18.09,18.02 90 bottom
C113  15.9,17.74 180 bottom
C114  15.9,19.27 0 bottom
CON_ANALOG1  20.59,17.15 270 top
CON_CAN/I2C1  3.68,22.1 270 top
CON_GPIO  11.28,7.78 0 top
CON_I2C2  37.36,26.52 180 top
CON_SPI  13.13,26.52 180 top
CON_UART1/5  [PB-53398-06']  23.79,7.78 0 top
CON_UART2  26.16,26.52 180 top
CON_UART3  37.43,7.78 0 top
CON_USB  11.28,5.72 0 bottom
CON_USB_MICRO  1.62,9.68 270 top
D3  5.91,14.31 270 top
IC9  9,19.3 270 top
IC101  9,19.3 90 bottom
IC102  15.84,22.77 0 bottom
JP1  41.59,10.87 180 top
JP2  6.65,24.08 90 top
JP3  7.87,21.49 0 top
JP6  38.88,6.1 0 bottom
JP7  37.89,7.62 180 bottom
JP8  21.87,10.9 270 top
JP9  23.09,10.9 270 top
JP10  2.99,10.39 90 bottom
JP11  1.32,9.91 90 bottom
JP12  38.33,24.69 90 bottom
JP13  42.52,13.57 270 top
JTAG  30.63,13.26 270 top
L1  23.86,18.27 270 bottom
L101  18.5,23.4 270 bottom
LED1  23.35,20.6 270 top
LED2  25.45,20.6 270 top
LED3  27.55,20.6 270 top
LED4  29.65,20.6 270 top
LED5  31.75,20.6 270 top
LEDVIN  16.95,9.22 270 top
LT_I2C2  3.52,11.21 90 bottom
PH1  44.4,27.42 0 top
PH2  44.4,21.42 0 top
PH3  44.4,15.42 0 top
PH4  44.4,9.42 0 top
Q1  24.1,14.95 180 bottom
R1  6.4,12.55 0 top
R2  17.4,11.5 270 bottom
R3  39.47,8.08 90 bottom
R4  33.42,22.13 90 top
R5  33.17,24.44 270 top
R6  25.76,5.34 180 bottom
R7  29.53,17.12 180 top
R8  25.45,22.55 90 top
R9  16.3,11.5 270 bottom
R10  23.35,22.55 90 top
R11  8.55,12.4 0 top
R12  31.75,22.55 90 top
R17  7.94,24.08 270 top
R18  7.87,22.56 0 top
R23  18.29,9.22 270 top
R24  23.32,5.34 0 bottom
R25  5.58,14.84 90 bottom
R26  26.61,24.91 90 bottom
R27  42.42,19.74 270 top
R28  41.91,9.63 180 top
R29  24.43,11.36 90 top
R30  15.85,9.22 90 top
R31  41.71,7.98 0 bottom
R33  3.2,6.54 270 bottom
R34  1.37,7.34 270 bottom
R37  29.65,22.55 90 top
R38  27.55,22.55 90 top
R39  41.68,6.86 0 bottom
R40  41.61,5.72 0 bottom
R41  41.45,24.77 180 top
R42  41.45,23.7 180 top
R43  2.34,14.86 90 bottom
R44  3.81,15.4 90 bottom
R45  41.45,22.59 180 top
R55  5.44,26.9 270 bottom
R56  4.14,27.64 90 bottom
R58  4.14,25.46 90 bottom
R59  2.9,25.45 270 bottom
R60  2.97,27.63 270 bottom
R61  1.65,25.45 270 bottom
SW1  10.2,14.1 0 top
U1  3.52,20.45 0 bottom
U2  34.97,17.06 180 bottom
U102  10.9,13.4 0 bottom
U103  16.45,15 90 bottom
VREG1  37.97,16.92 90 top

### Tracks (layer width: path | path; a pad name or v marks a point on that pad's centre or on a via)
+3V3  (via drill 0.3)
  Top 0.15: R12.P$2 32.23,23.53 v32.23,24.08 | R37.P$2 v28.9,23.05 | R10.P$2 v22.6,23.05 | R8.P$2 v24.7,23.05 | R38.P$2 v26.8,23.05 | R11.P$1 7.2,13.25 v7.2,13.85
  Top 0.3: CON_SPI.2 15.63,25.68 16.3,26.35 17.4,26.35 17.75,26 v17.75,25.85 | CON_UART2.2 26.78,24.87 v27.4,24.25 | R7.P$2 29.03,16.24 JTAG.1 27.4,15.8 26.7,15.1 v26.7,13.65 | VREG1.3 v38.95,17.55 | VREG1.3 39.54,17.56 v38.95,18.15 v38.95,16.95 39.56,17.56 VREG1.3
  Top 0.4: C37.+ 39.03,22.86 v39.34,23.17
  Top 0.406: CON_ANALOG1.2 v22.99,19.02 v22.99,19.03 | CON_I2C2.2 37.98,26.35 v37.97,26.37 | R5.P$1 33.08,24.94 v32.23,24.08 | R4.P$1 33.9,21.63 34.06,21.47 34.06,20.9 v34.08,20.88 | CON_GPIO.2 10.65,8.63 v11.28,8 | v23.95,10.21 23.95,10.37 R29.P$1 23.93,10.85 23.45,11.32 JP9.P$1
  Top 0.61: C36.P$1 v39.34,23.17
  Bottom 0.15: R26.P$1 27.24,24.41 v27.4,24.25
  Bottom 0.3: R9.P$2 16.85,11 | 16.85,11 R2.P$2 | v16.85,10.4 16.85,11 | L1.P$1 23.25,18.77 v22.99,19.03
  Bottom 0.305: 40.67,13.31 U2.48 40.97,13.07 C12.P$2 | v5.51,8.97 5.18,9.3 4.04,9.3 3.85,9.11 LT_I2C2.2 3.85,7.51 4.04,7.32 4.04,6.33 3.81,6.1 3.26,6.1 R33.P$2 3.19,6.02 2.19,6.02 R34.P$2 | C10.P$2 32.14,24.08 v32.23,24.08 v32.22,24.09 U2.19 | U2.32 38.98,22.81 v39.34,23.17 39.35,23.16 | U2.1 28.68,13.31 27.69,12.32 v26.72,12.32 | U2.64 31.22,11.06 v30.61,10.44
  Bottom 0.4: C11.P$2 39.58,23.41 v39.34,23.17 | C9.P$1 30.61,9.76 C5.P$2
  Bottom 0.406: 39.35,23.16 39.36,23.16 | JP7.P$1 v36.58,7.62 | C5.P$2 30.69,10.37 v30.61,10.44 | C12.P$2 42.52,12.58 v42.21,12.27
  pour Route15 (isolate 0.203, rank 4): 16.38,7.75 5.21,7.8 3.63,9.38 3.65,29.48 44.6,29.34 44.6,28.73 44.52,12.09 41.83,12.09 41.83,12.88 37.89,12.86 37.89,8.26 36.82,7.29 31.52,7.29 29.46,9.33 25.15,9.33 23.37,7.55 21.84,7.55 20.19,9.2 17.78,9.2
+5V  (via drill 0.3)
  Top 0.3: CON_ANALOG1.3 20.83,17.77 18.4,20.2 12.05,20.2 v12,20.25 | 10.3,20.95 10.7,21.35 C26.P$1
  Top 0.4: JP3.P$2 8.34,21.45 C1.P$1 10.3,20.95 IC9.5
  Bottom 0.3: U1.3 2.89,19.69 3.35,20.15 v3.8,20.15 | R56.P$2 4.84,28.14 v4.9,28.2 | 5.58,15.38 5.58,15.73 v5.85,16
  Bottom 0.406: R60.P$1 4.13,28.13 R56.P$2 | C2.P$1 R43.P$2 2.87,15.9 R44.P$2 3.92,16.01 4.95,16.01 5.58,15.38 R25.P$2
  other vias: 11.35,20.05
  pour Route15 (rank 2): 3.7,29.45 3.7,15.35 7,15.35 7,17.45 12.15,17.45 12.15,22.65 7.1,22.65 7.1,29.45
  pour Top (no thermals): 12.2,20.5 12.2,19.85 9.75,19.85 9.75,20.5
ADC_1  (via drill 0.3)
  Top 0.15: CON_ANALOG1.4 26.07,16.52 v27.4,17.85
  Bottom 0.15: U2.11 27.86,18.31 v27.4,17.85
ADC_2  (via drill 0.3)
  Top 0.15: CON_ANALOG1.5 25.32,15.27 27.05,17 v27.4,17
  Bottom 0.15: U2.8 27.59,16.81 v27.4,17
ADC_3  (via drill 0.3)
  Top 0.15: v28.1,17.55 28.1,16.75 27.85,16.5 27.05,16.5 25.15,14.6 23.6,14.6 23.02,14.02 CON_ANALOG1.6
  Top 0.152: CON_ANALOG1.6 21.87,14
  Bottom 0.15: U2.9 28.34,17.31 v28.1,17.55
BARO_+3V3
  Bottom 0.3: IC102.1 17.2,24.9 C101.P$1
  Bottom 0.406: L101.P$1 C101.P$1
BIND_BUT  (via drill 0.3)
  Top 0.15: v13.6,16.8 11.9,15.1 SW1.2 10.25,14.1 9.35,13.2 9.35,12.7 R11.P$2
  Bottom 0.15: U2.28 36.72,24.13 32.85,28 9.8,28 9.35,27.55 9.35,26.75 11.65,24.45 12.6,24.45 13.4,23.65 13.4,17 v13.6,16.8
BOOT0  (via drill 0.3)
  Top 0.152: R30.P$2 15,9.72 v14.53,9.25
  Bottom 0.15: v14.53,9.25 15.37,9.25 16.92,7.7
  Bottom 0.152: U2.60 33.22,9.21 32.41,8.39 23.85,8.39 23.16,7.7 16.92,7.7
CAN_CENTER
  Bottom 0.305: R58.P$2 R59.P$1 | R59.P$1 2.9,27.06 R60.P$2 | R59.P$1 R61.P$1 C42.P$2
CAN_H  (via drill 0.3)
  Top 0.406: CON_CAN/I2C1.5 3.86,20.85 v3.83,20.88
  Bottom 0.305: v3.83,20.88 4.16,21.21 U1.7 4.16,24.94 R58.P$1
CAN_L  (via drill 0.3)
  Top 0.305: CON_CAN/I2C1.4 3.52,22.1 v2.92,21.49
  Bottom 0.305: R59.P$2 U1.6 2.89,21.52 v2.92,21.49
CAN_RX
  Bottom 0.15: 1.88,16.51 6.05,16.51 6.38,16.19 6.38,10.51 6.38,10.43 7.87,8.93 8.86,8.93 | 23.16,8.23 18.52,8.23 17.3,9.45 15.7,9.45 15.4,9.75
  Bottom 0.152: 1.88,16.51 1.62,16.77 U1.4 | 8.86,8.93 9.23,9.3 13.75,9.3 14.2,9.75 15.4,9.75 | U2.61 32.72,10.64 32.92,10.44 32.92,9.38 32.23,8.69 23.62,8.69 23.16,8.23
CAN_TX
  Bottom 0.15: U1.1 6.19,17.85 6.67,17.37 6.67,10.57 8,9.25 8.71,9.25 9.11,9.65 | 22.96,8.54 18.76,8.54 17.55,9.75 15.85,9.75 15.45,10.15
  Bottom 0.152: U2.62 32.22,12.1 31.97,12.35 31.09,12.35 29.72,10.98 25.39,10.98 22.96,8.54 | 9.11,9.65 13.6,9.65 14.1,10.15 15.45,10.15
EXTSPI_DRDY  (via drill 0.3)
  Top 0.15: CON_SPI.7 9.38,26.68 v9.9,27.2
  Bottom 0.15: U2.27 36.22,24.18 32.7,27.7 10.4,27.7 v9.9,27.2
EXTSPI_MISO  (via drill 0.3)
  Top 0.15: CON_SPI.4 13.13,27.18 v13.15,27.2
  Bottom 0.15: U2.22 33.72,25.78 32.4,27.1 15.2,27.1 14.8,26.7 13.65,26.7 v13.15,27.2
EXTSPI_MOSI  (via drill 0.3)
  Top 0.15: CON_SPI.3 14.38,27.18 v14.4,27.2
  Bottom 0.15: U2.23 34.22,25.73 32.55,27.4 14.6,27.4 v14.4,27.2
EXTSPI_SCK  (via drill 0.3)
  Top 0.15: CON_SPI.5 11.88,27.18 v11.9,27.2
  Bottom 0.15: U2.21 33.22,25.83 32.25,26.8 15.45,26.8 15.05,26.4 12.7,26.4 v11.9,27.2
EXTSPI_SS  (via drill 0.3)
  Top 0.15: CON_SPI.6 10.63,27.18 v10.65,27.2
  Bottom 0.15: U2.20 32.72,25.88 32.1,26.5 15.7,26.5 15.3,26.1 11.75,26.1 v10.65,27.2
GND  (via drill 0.3)
  Top 0.3: VREG1.8 36.06,14.32 C39.-
  Top 0.305: CON_ANALOG1.1 21.81,20.27 | 35.92,20.98 35.89,21.01 | CON_USB_MICRO.PIN_5 5.23,8.38 v5.43,8.18
  Top 0.4: C39.- 36.06,13.31 36.8,14.05 36.8,14.45 36.9,14.55 36.9,14.76 v36.91,14.78 | C37.- 35.4,20.39 35.4,18.8
  Top 0.406: C35.P$2 41.09,21.67 v41.2,21.77
  Top 0.61: VREG1.7 VREG1.6 | VREG1.5 35.38,18.82 35.38,17.53
  Bottom 0.15: U102.11 10.15,11.01 C110.P$2 | U102.18 8.05,14.65 C109.P$2 | C4.P$1 26.18,15.93 Q1.P$2 | v15.05,16.5 15.28,16.27 U103.9
  Bottom 0.3: 16.7,17.69 U103.11
  Bottom 0.305: 4.16,17.02 U1.2 | U2.12 30.21,18.81 v30.53,19.13 | LT_I2C2.1 5.33,8.28 v5.43,8.18 | U2.18 31.72,23.6 31.39,23.93 v30.93,23.93 30.93,24.09 30.58,24.44 C10.P$1 | U2.63 31.72,9.72 | C7.P$1 38.45,25.19 38.33,25.07 | 16.7,17.69 C113.P$2
  Bottom 0.4: IC101.2
  Bottom 0.406: U1.2 4.16,18.9 v3.63,19.44 | C9.P$2 27.2,9.76 26.92,9.48 25.93,9.48 | C11.P$1 40.49,24.67 40.01,25.15 39.44,25.15 C7.P$1 | v4.88,27.39 5.38,27.39 5.41,27.36
  other vias: 7.08,25.94 0.78,25.89 10.4,22.2 19.89,5.26 34.69,5.19 37.28,5.19 39.72,5.19 36.88,16.9 0.93,20.81 4.29,28.96 0.53,12.32 3.04,5.24 35.74,10.21 15.08,8.72 32.38,9.76 25.68,10.44 37.79,27.11 42.24,14.94 41.45,12.02 10.06,8.01 5.87,10.9 37.51,21.31 40.13,22.71 21.95,5.26 27.89,5.11 15.85,23.4 15.85,22.15 24.1,14.05 32.95,16.75 24.1,15.95 15.9,18.5 17.9,19.45 9,19.3 9,18.35 7.22,16
  pour Route2 (isolate 0.203): 0,4.5 0,29.8 50.7,29.8 50.7,4.5
  pour Bottom (isolate 0.203, rank 2): 0.02,4.5 0,29.8 50.7,29.8 50.7,4.5
  pour Top (isolate 0.203, rank 2): 0.02,29.8 50.7,29.8 50.7,4.5 0.02,4.5 0.02,22.41 4.29,22.41 4.29,25.38 0.02,25.38
  pour Top (no thermals): 0.02,26.14 1.85,26.14 1.85,22.25 0.02,22.25
I2C2_SCL  (via drill 0.3)
  Top 0.152: v36.72,26.37 36.73,26.36 CON_I2C2.3 36.73,24.69 34.67,22.63 R4.P$2
  Bottom 0.152: U2.29 37.22,24.58 36.73,25.07 36.73,26.36 v36.72,26.37
I2C2_SDA  (via drill 0.3)
  Top 0.152: R5.P$2 34.75,23.94 35.48,24.67 CON_I2C2.4 35.48,26.45 v35.78,26.75
  Bottom 0.152: U2.30 37.72,25.02 37.39,25.35 37.39,26.67 37.06,27 36.04,27 v35.78,26.75
IMU+3V3  (via drill 0.3)
  Bottom 0.3: C105.P$1 10.3,18.25 IC101.5 | v15.1,13.2 15.25,13.35 15.7,13.35 | U102.13 7.95,12.15 C108.P$1 7.45,11.95 v7.45,11.65 | L101.P$2 18.5,22 v19.3,21.2 | 15.7,13.35 15.94,13.11 16.48,13.11 16.7,13.34 U103.2 | 15.7,13.35 U103.4 | 15.7,13.35 | v18.09,16.73 18.09,16.12 U103.13
  Bottom 0.305: C112.P$1 v18.09,16.73 v18.1,16.72
  other vias: 12,18.65 12,17.95 11.3,17.95
  pour Bottom (no thermals): 9.7,18.9 9.7,17.7 12.2,17.7 12.2,18.9
  pour Route15: 7.45,17.4 10.55,17.4 12,18.85 15.55,18.85 18.4,21.7 19.05,21.7 19.35,21.4 19.35,13.05 17.2,13.05 14.35,10.2 7.4,10.2
IMU_BARO_CS  (via drill 0.3)
  Top 0.15: v18.8,13.65 v18.8,15.3
  Bottom 0.15: U2.2 28.56,13.81 27.6,12.85 19.6,12.85 v18.8,13.65 | v18.8,15.3 18.8,19.95 17.86,20.89 IC102.4
  Bottom 0.152: IC102.4 IC102.5
IMU_MAG_INT
  Bottom 0.15: U2.3 28.61,14.31 27.45,13.15 20.15,13.15 18.55,14.75 U103.15
IMU_MPU_CS
  Bottom 0.15: U2.33 40.6,20.94 40.6,21.9 41.15,22.45 41.15,24.65 37.5,28.3 9.65,28.3 9.05,27.7 9.05,26.55 11.45,24.15 12.45,24.15 13.1,23.5 13.1,16.4 14.2,15.3 14.2,11.95 12.8,10.55 12.05,10.55 11.65,10.95 U102.8
IMU_MPU_INT  (via drill 0.3)
  Top 0.15: v14.75,11.15 14.45,10.85 9.6,10.85 v9.05,11.4 | 26.29,7.24 26.29,11.11 25.71,11.69
  Top 0.152: 25.71,11.69 24.74,11.69 24.57,11.86 R29.P$2 24.1,12.2 v23.34,12.2 | 26.29,7.24 v26.36,7.17
  Bottom 0.15: 22.38,12.2 18.95,12.2 18.25,11.5 15.85,11.5 15.5,11.15 v14.75,11.15 | v9.05,11.4 U102.12
  Bottom 0.152: 22.38,12.2 v23.34,12.2 | U2.57 34.82,11.21 34.82,9.3 32.99,7.47 26.67,7.47 v26.36,7.17
IMU_SPI_MISO  (via drill 0.3)
  Top 0.15: v11.3,23.15 12.1,23.15 13.75,21.5 v13.9,21.5
  Bottom 0.15: U2.35 41.31,19.81 42,20.5 42,24.8 37.9,28.9 9.35,28.9 8.4,27.95 8.4,25.8 11.05,23.15 v11.3,23.15 | IC102.6 14.54,22.14 v13.9,21.5 13.7,21.3 13.7,20.65 14.1,20.25 14.1,15.85 14.5,15.45 14.5,11.8 12.85,10.15 11.75,10.15 11.15,10.75 U102.9
IMU_SPI_MOSI  (via drill 0.3)
  Top 0.15: v9.3,24.15 9.8,23.65 v12.25,23.65 13.15,22.75 v13.9,22.75
  Bottom 0.15: U2.36 41.31,19.31 42.3,20.3 42.3,25 38.1,29.2 9.2,29.2 8.1,28.1 8.1,25.35 v9.3,24.15 | IC102.7 14.54,23.39 v13.9,22.75 | v12.25,23.65 12.8,23.1 12.8,16.45 12.15,15.8 U102.24
IMU_SPI_SCK  (via drill 0.3)
  Top 0.15: v10.75,24.15 v13.75,24.15
  Bottom 0.15: U2.34 41.31,20.31 41.7,20.7 41.7,24.6 37.7,28.6 9.5,28.6 8.75,27.85 8.75,26.15 v10.75,24.15 11.25,23.65 11.5,23.65 12.5,22.65 12.5,16.65 11.65,15.8 U102.23 | IC102.8 14.24,24.64 v13.75,24.15
JTAG_RST  (via drill 0.3)
  Top 0.15: C27.P$2 30.66,16.54 v30.66,16.29
  Top 0.152: JTAG.10 31.17,10.72 30.66,11.23 v30.66,16.29 | C27.P$2 R7.P$1
  Bottom 0.152: v30.66,16.29 30.63,16.31 U2.7
JTAG_TCK  (via drill 0.3)
  Top 0.152: v34.52,14.18 34.14,14.18 33.78,14.53 JTAG.4
  Bottom 0.152: U2.49 38.72,12.18 37.77,13.14 35.94,13.14 34.9,14.18 v34.52,14.18
JTAG_TDI  (via drill 0.3)
  Top 0.152: JTAG.8 34.27,11.99 35.05,11.21 37.24,11.21 v38.33,10.12
  Bottom 0.152: v38.33,10.12 38.25,10.19 38.25,11.29 U2.50
JTAG_TDO  (via drill 0.3)
  Top 0.152: JTAG.6 v34.52,13.26
  Bottom 0.152: U2.55 35.72,12.29 34.75,13.26 v34.52,13.26
JTAG_TMS  (via drill 0.3)
  Top 0.15: v37.5,15.27 37.12,15.65 32.81,15.65 JTAG.2
  Top 0.152: JTAG.2
  Bottom 0.152: U2.46 38.45,14.31 v37.5,15.27
LED1  (via drill 0.3)
  Top 0.15: v24.15,20.1 LED1.C
  Bottom 0.15: U2.41 39.94,16.81 39.6,17.15 39.6,18.3 39.05,18.85 35.05,18.85 32.7,21.2 24.75,21.2 24.15,20.6 v24.15,20.1
LED2  (via drill 0.3)
  Top 0.15: v33.65,16.85 33.65,17.15 33.05,17.75 28.8,17.75 27.55,19 26.1,19 25.45,19.65 LED2.C
  Top 0.152: v13.87,8 13.15,8.72 CON_GPIO.4
  Bottom 0.15: U2.56 35.22,12.18 34.85,12.55 34.1,12.55 33.65,13 v33.65,16.85
  Bottom 0.152: v13.87,8 15.09,6.79 23.62,6.79 24.23,7.4 25.38,7.4 26.14,6.63 26.59,6.63 27.13,7.17 33.25,7.17 35.22,9.14 U2.56
LED3  (via drill 0.3)
  Top 0.15: v30.8,18.3 29.15,18.3 27.55,19.9 LED3.C
  Bottom 0.15: U2.10 30.31,17.81 v30.8,18.3
LED4  (via drill 0.3)
  Top 0.15: LED4.C 30.45,20.9 v30.45,21.7
  Bottom 0.15: U2.25 35.22,22.07 34.65,21.5 30.65,21.5 v30.45,21.7
LED5  (via drill 0.3)
  Top 0.15: v31.5,19.3 31.75,19.55 LED5.C
  Bottom 0.15: U2.4 30.66,14.81 31.5,15.65 v31.5,19.3
LT_I2C1_SCL  (via drill 0.3)
  Top 0.152: CON_CAN/I2C1.6 4.68,19.6 3.91,18.83 3.91,17.43 4.21,17.13 4.21,15.7 v4.54,15.37
  Bottom 0.152: JP10.P$2 3.2,11.35 LT_I2C2.6 3.2,13.34 3.81,13.95 R44.P$1 4.07,14.9 v4.54,15.37
LT_I2C1_SDA  (via drill 0.3)
  Top 0.152: CON_CAN/I2C1.7 4.81,18.35 4.67,18.22 4.67,15.98 5.03,15.62 5.03,15.17 4.72,14.86 4.19,14.86 3.58,14.25 v3.1,14.25
  Bottom 0.152: JP11.P$2 1.31,11.96 1.83,12.48 LT_I2C2.5 2.55,13.48 2.34,13.7 R43.P$1 2.99,14.36 v3.1,14.25
N$1
  Bottom 0.406: U1.8 R55.P$2 4.87,26.4 R56.P$1
N$2
  Bottom 0.15: C109.P$1 8.45,16.05 9.9,16.05 10.15,15.8 U102.20
N$3
  Bottom 0.15: C110.P$1 10.65,10.51 U102.10
N$4
  Top 0.15: R10.P$1 LED1.A
N$5
  Bottom 0.3: C113.P$1 16.2,16.69 U103.10
N$6
  Top 0.3: IC9.4 10.3,17 C13.P$1
N$7
  Top 0.406: C35.P$1 41.09,18.93 41.1,18.93 40.67,18.93 VREG1.4
N$8
  Bottom 0.254: LT_I2C2.7 LT_I2C2.8
  Bottom 0.406: R25.P$1 5.74,14.19 C15.P$1 4.64,12.62 LT_I2C2.8
N$10
  Top 0.15: R8.P$1 LED2.A
N$11
  cutout Top: 14.94,13.49 14.94,16.53 17.89,16.53 17.89,13.49
  cutout Route2: 14.94,13.49 14.94,16.53 17.89,16.53 17.89,13.49
  cutout Bottom: 14.94,13.49 14.94,16.53 17.89,16.53 17.89,13.49
  cutout Route15: 14.94,13.49 14.94,16.53 17.89,16.53 17.89,13.49
N$12
  Top 0.406: LEDVIN.A R23.P$1
N$13
  Top 0.15: R12.P$1 LED5.A
N$14
  Top 0.15: R37.P$1 LED4.A
N$15
  Top 0.15: R38.P$1 LED3.A
N$19
  Bottom 0.3: C106.P$2 10.25,20.3 IC101.4
N$34
  Bottom 0.3: 14.49,16.08 14.83,15.75 U103.8
  Bottom 0.305: C114.P$2 14.86,19.27 14.49,18.9 14.49,16.08
N$48
  Bottom 0.3: 17.3,18.62 17.3,16.38 U103.12
  Bottom 0.305: 17.3,18.62 C114.P$1
OSC_IN
  Bottom 0.15: Q1.P$3 26.18,13.97 C4.P$2 27.7,14.45 28.56,15.31 U2.5
OSC_OUT
  Bottom 0.15: C6.P$1 22.02,15.93 Q1.P$1 23.88,14.95 27.7,14.95 28.56,15.81 U2.6
PC12  (via drill 0.3)
  Top 0.152: v12.57,8 11.9,8.68 CON_GPIO.3
  Bottom 0.152: U2.53 36.72,9.58 33.09,5.95 27.58,5.95 27.2,6.33 25.53,6.33 24.92,6.94 24.28,6.94 23.82,6.48 14.71,6.48 13.18,8 v12.57,8
S1
  Top 0.15: 44.4,26.72 PH1.1
  Top 0.152: R41.P$1 42.44,24.77 44.4,26.72
S2
  Top 0.15: 43.22,23.7 PH1.4
  Top 0.152: R42.P$1 43.22,23.7
S3
  Top 0.15: 43.23,22.59 PH2.1
  Top 0.152: 43.23,22.59 R45.P$1
S4
  Top 0.15: 43.04,20.24 PH2.4
  Top 0.152: 43.04,20.24 R27.P$1
S5
  Top 0.15: PH3.1 44.4,15.37 44.26,15.24
  Top 0.152: R28.P$1 43.2,10.43 43.2,14.18 44.26,15.24 44.4,15.37
S6
  Bottom 0.15: 44.4,11.71 PH3.4
  Bottom 0.152: R31.P$1 43.13,8.9 43.13,10.44 44.4,11.71
S7
  Bottom 0.15: 44.4,8.81 PH4.1
  Bottom 0.152: R39.P$1 42.45,6.86 44.4,8.81
S8
  Bottom 0.15: 43.24,5.72 PH4.4
  Bottom 0.152: R40.P$1 43.24,5.72
SCL  (via drill 0.3)
  Top 0.15: v12.9,11.4 13.15,11.65 v15.25,11.65
  Bottom 0.15: U102.7 v12.9,11.4 | v15.25,11.65 15.6,12 R9.P$1 16.3,12.4 17.2,13.3 U103.1
SDA  (via drill 0.3)
  Top 0.15: v13.7,12.3 14.1,12.7 16.55,12.7 17.5,13.65 v17.8,13.65
  Bottom 0.15: U102.6 13.55,12.15 v13.7,12.3 | R2.P$1 17.4,12.9 17.8,13.3 v17.8,13.65 17.73,13.72 U103.16
SERVO_1  (via drill 0.3)
  Top 0.15: R41.P$2 41.98,25.8 v42.45,25.8
  Bottom 0.15: U2.37 41.31,18.81 42.6,20.1 42.6,25.65 v42.45,25.8
SERVO_2  (via drill 0.3)
  Top 0.15: R42.P$2 41.48,24.23 43.06,24.23 v43.12,24.29
  Bottom 0.15: U2.38 42.16,18.31 43,19.15 43,24.17 v43.12,24.29
SERVO_3  (via drill 0.3)
  Top 0.15: R45.P$2 40.95,22.65 41.45,23.15 v43.5,23.15
  Bottom 0.15: U2.39 42.11,17.81 43.3,19 43.3,22.95 v43.5,23.15
SERVO_4  (via drill 0.3)
  Top 0.152: R27.P$2 42.42,18.08 v42.79,17.71
  Bottom 0.203: U2.40 42.4,17.31 v42.79,17.71
SERVO_5  (via drill 0.3)
  Top 0.152: v37.99,17.91 37.99,17.56 38.43,17.12 38.43,14.94 37.64,14.15 37.64,11.69 38.18,11.15 38.61,11.15 39.55,10.21 40.31,10.21 40.89,9.63 R28.P$2
  Bottom 0.15: 33.09,19.81 35.47,17.43 37.51,17.43
  Bottom 0.152: 33.09,19.81 U2.14 | v37.99,17.91 37.51,17.43
SERVO_6  (via drill 0.3)
  Top 0.152: v37.05,18.04 38.13,16.96 38.13,15.09 37.29,14.26 37.29,11.59 38.03,10.85 38.46,10.85 39.4,9.91 40.08,9.91 40.69,9.3 40.69,8.69 40.23,8.23 v40.23,7.55
  Bottom 0.15: 36.85,17.84 35.57,17.84 33.2,20.2
  Bottom 0.152: v37.05,18.04 36.85,17.84 | 33.2,20.2 29.95,20.2 29.84,20.31 U2.15 | v40.23,7.55 40.77,7.55 R31.P$2
SERVO_7/I2C1_SCL  (via drill 0.3)
  Top 0.15: 34.29,8.62 36.88,6.02 39.47,6.02
  Top 0.152: 39.47,6.02 v40.31,6.86 | v34.29,9.99 34.29,8.62
  Bottom 0.15: 9.3,8.31 7.14,8.31 6.25,9.2
  Bottom 0.152: 6.34,9.1 6.25,9.2 5.66,9.78 3.71,9.78 3.58,9.66 3,9.66 JP10.P$1 3,9.63 3,9.17 3.2,8.98 LT_I2C2.3 R33.P$1 | R33.P$1 | v40.31,6.86 R39.P$2 | 9.3,8.31 9.68,8.69 13.87,8.69 15.47,7.09 23.5,7.09 24.18,7.78 32.84,7.78 34.29,9.22 v34.29,9.99 34.29,11.25 U2.58
SERVO_8/I2C1_SDA  (via drill 0.3)
  Top 0.15: v40.23,5.72 36.65,5.72 33.72,8.65
  Top 0.152: v33.72,9.48 33.72,8.65
  Bottom 0.15: 9.14,8.62 7.39,8.62 6.68,9.33
  Bottom 0.152: LT_I2C2.4 2.55,7.94 2.46,7.85 1.39,7.85 R34.P$1 1.4,7.87 1.4,8.41 1.31,8.49 JP11.P$1 1.46,9.16 2.11,9.81 2.11,10.16 2.31,10.37 4.54,10.37 4.74,10.16 5.84,10.16 6.68,9.33 | v40.23,5.72 R40.P$2 | 9.14,8.62 9.53,9 14.02,9 15.62,7.4 23.34,7.4 24.03,8.08 32.61,8.08 33.72,9.19 v33.72,9.48 U2.59
SERVO_BUS  (via drill 0.3)
  Top 0.3: v42.62,11.64 42.01,11.02 JP1.P$1
  Top 1.5: PH1.2 PH1.5 PH2.2 PH2.5 PH3.2 PH3.5 PH4.2 PH4.5
  Route15 0.4: 42.59,11.6 v42.62,11.64 41.47,10.48 41.47,8.97 42.23,8.2 42.25,8.2 | 45.62,8.2 PH4.5
  Route15 0.406: 42.25,8.2 45.62,8.2
  Route15 1.5: PH1.2 PH4.5
  Bottom 1.5: PH1.2 PH1.5 PH2.2 PH2.5 PH3.2 PH3.5 PH4.2 PH4.5
U1_U5_POW  (via drill 0.3)  (1 unrouted)
  Top 0.406: CON_UART1/5.5 25.67,6.39 24.92,5.64 v24.54,5.64 24.16,5.64 21.92,7.88 CON_UART1/5.2 21.87,9.08 JP8.P$2 JP9.P$2
  Bottom 0.406: R6.P$1 24.84,5.34 v24.54,5.64 24.23,5.34
U3_POW  (via drill 0.3)
  Top 0.305: CON_UART3.2 36.82,9.01
  Top 0.406: 36.82,9.01 36.82,8.44 38.35,6.92 v38.35,6.86
  Bottom 0.406: JP6.P$2 38.46,6.75 v38.35,6.86 38.31,6.9 JP7.P$2 38.36,7.58 R3.P$1
UART1_RX  (via drill 0.3)
  Top 0.152: CON_UART1/5.3 23.17,7.7 v24.54,6.33
  Bottom 0.152: U2.43 42.18,15.81 43.13,14.86 43.13,11.13 40.08,8.08 38.94,8.08 38.71,8.31 35.97,8.31 33.3,5.64 27.43,5.64 27.05,6.02 25.22,6.02 24.92,6.33 v24.54,6.33 24.38,6.18 23.39,6.18 22.82,5.6 R24.P$2
UART2_RX  (via drill 0.3)
  Top 0.15: v23.45,25.25 24.26,25.25 CON_UART2.4
  Bottom 0.15: U2.17 28.63,25.41 R26.P$2 23.61,25.41 v23.45,25.25
UART2_TX  (via drill 0.3)
  Top 0.15: CON_UART2.3 25.55,25.25 25.55,24.5 26.3,23.75 30.2,23.75 30.95,23 v30.95,20.7
  Bottom 0.15: 29.22,20.83 U2.16 29.29,20.75 29.85,20.75 29.9,20.7 v30.95,20.7
UART3_RX  (via drill 0.3)
  Top 0.152: v40.16,9.15 39.43,9.15 CON_UART3.4
  Bottom 0.152: U2.52 37.22,10.63 37.03,10.44 37.03,9.83 37.41,9.45 39.85,9.45 v40.16,9.15 39.59,8.58 R3.P$2
UART3_TX  (via drill 0.3)
  Top 0.152: v37.57,10.12 38.06,9.62 CON_UART3.3
  Bottom 0.152: U2.51 37.72,10.27 v37.57,10.12
UART5_RX  (via drill 0.3)
  Top 0.152: CON_UART1/5.6 26.92,7.3 v27.74,6.48 26.98,5.72 v26.98,5.34
  Bottom 0.152: U2.54 36.22,9.61 33.09,6.48 v27.74,6.48 | R6.P$2 v26.98,5.34
USB_DM  (via drill 0.3)
  Top 0.15: v25.95,12.3 25.1,13.15 17.45,13.15 14.65,10.35 8.9,10.35 8.5,10.75 v8.2,10.75 7.9,10.75 7.5,10.35 4.36,10.35 CON_USB_MICRO.PIN_2 | v8.2,9.75 8.2,8.45 9.85,6.8 10.82,6.8 CON_USB.2
  Top 0.152: CON_USB_MICRO.PIN_2 4.36,10.34
  Bottom 0.15: v25.95,12.3 26.61,11.64 29.39,11.64 31.9,14.15 31.9,17 32.7,17.8 34.3,17.8 36.02,16.08 38.3,16.08 | v8.2,9.75 v8.2,10.75
  Bottom 0.152: U2.44 39.07,15.31 38.3,16.08
USB_DP  (via drill 0.3)
  Top 0.15: v25.2,12.3 24.65,12.85 17.6,12.85 14.75,10 8.75,10 8.5,10.25 7.9,10.25 7.65,10 6.7,10 6.38,9.68 | 6.38,9.68 CON_USB_MICRO.PIN_3 | 6.38,9.68 9.56,6.5 10.15,6.5 10.65,6 CON_USB.3
  Bottom 0.15: U2.45 39.14,14.81 38.2,15.75 35.9,15.75 34.15,17.5 32.85,17.5 32.2,16.85 32.2,14 29.5,11.3 26.2,11.3 v25.2,12.3
USB_VBUS  (via drill 0.3)
  Top 0.3: CON_USB_MICRO.PIN_1 4.93,10.98 5.9,11.95 R1.P$1 | 5.91,12.56 D3.A 5.9,13.57 5.9,13.85 5.42,14.33 v4.65,14.33
  Top 0.4: R1.P$1 5.91,12.56
  Top 0.406: v13.18,7.32 13.18,5.75 CON_USB.1
  Route15 0.406: v4.65,14.33 4.34,14.33 3.35,13.34 3.35,9 5.03,7.32 v13.18,7.32 15.39,7.32 16.92,8.84 18.9,8.84 19.13,8.62 20.5,8.62 20.73,8.84 29.57,8.84 31.62,6.79 36.88,6.79 37.34,7.24 37.34,8.77 36.65,9.45 36.65,11.43 39.01,13.8 v39.01,16.08
  Bottom 0.152: v39.01,16.08 39.25,16.31 U2.42
V_BAT
  Top 0.3: 3.23,24.6 CON_CAN/I2C1.2 5.03,24.51 JP2.P$2
  Top 0.406: 3.23,24.6 3.22,24.62 | 6.57,24.58 JP2.P$2 6.72,24.58 R17.P$1
  pour Top (no thermals): 2.31,25 2.31,24.08 3.91,24.08 3.91,25
V_BAT_MEAS  (via drill 0.3)
  Top 0.15: R17.P$2 8.28,23.58 8.55,23.85 8.55,27 9.55,28 16.35,28 18.4,25.95 v20.6,25.95
  Top 0.152: R18.P$1 7.37,23.01 R17.P$2
  Bottom 0.15: 31.09,21.81 34.43,21.81 34.72,22.11 | 30.79,22.11 30.79,22.76 28.65,24.9 23.95,24.9 23.8,24.75 21.8,24.75 v20.6,25.95
  Bottom 0.152: 34.72,22.11 U2.24 | 30.79,22.11 31.09,21.81
V_IN  (via drill 0.3)
  Top 0.3: 5.91,15.11 6.5,15.7 6.5,16.25 7.15,16.9 C3.P$1
  Top 0.4: JP3.P$1 7.45,20.5 IC101.3 | IC101.3 | 7.75,20.2 IC101.3 | IC101.3 7.75,20.2 | 7.75,20.2 v9,20.2 | IC101.3 7.05,20.25 6.6,19.8 6.6,18.7 6.95,18.35 IC101.1 C3.P$1 | D3.C 5.91,15.11 | JP1.P$2 40.62,11.42 v40.62,11.89
  Top 0.406: 3.15,23.35 CON_CAN/I2C1.3 6.34,23.35 JP2.P$1 6.65,21.73 6.88,21.49 JP3.P$1 | 3.15,23.35 3.1,23.35 3.07,23.32 | 3.15,23.35 2.52,22.72 2.52,22.18 2.08,21.75 v2.08,21.37 | VREG1.2 41.12,16.29 41.6,16.77 42.1,16.77 C38.P$1 | v17.68,8.21 17.77,8.21 R23.P$2 18.78,8.72 19.05,9 19.05,9.68 19.43,10.06 20.8,10.06 21.11,10.37 21.11,11.13 21.3,11.32 JP8.P$1 | 39.11,13.01 40.23,11.89 v40.62,11.89
  Top 0.508: VREG1.1 VREG1.2
  Top 0.61: C39.+ 39.11,13.01 39.11,14.63 39.5,15.02 VREG1.1
  Bottom 0.4: IC101.3 7.75,20.2 | 7.75,20.2 v9,20.2 | IC101.1 | 7.75,20.2 7,20.2 6.6,19.8 6.6,18.7 6.95,18.35 IC101.1 | C104.P$1 7.7,16.95 IC101.1
  Bottom 0.406: JP6.P$1 39.4,6.19 v39.4,6.86
  pour Top (no thermals): 2.31,23.7 2.31,22.79 3.91,22.79 3.91,23.7
  pour Route15 (isolate 0.203): 40.89,12.3 40.89,4.5 0,4.5 -0.05,21.89 3.05,21.86 3.02,9.12 4.8,7.32 16.13,7.32 17.58,8.77 17.53,8.77 29.26,8.84 29.21,8.82 31.24,6.79 37.08,6.79 38.35,8.06 38.35,12.3
VDDA
  Bottom 0.3: L1.P$2 24.17,17.77 C28.P$1 26.13,18.81 C31.P$2 27.49,19.31 U2.13
VSS1
  Bottom 0.152: U2.31 38.22,24.16 JP12.P$1
  Bottom 0.406: C7.P$2 38.41,24.19 JP12.P$1
VSS2  (via drill 0.3)
  Top 0.406: JP13.P$1 41.95,13.99 v41.76,13.8 41.49,14.07 C14.P$2
  Bottom 0.305: U2.47 41.74,13.81 v41.76,13.8

### Text on the board
tPlace: S1 | SPI1 | UART2 | I2C2 | JP2 | BAT | Paparazzi | UAV | S3 | S2 | CL | CAN | CH | CL | ALOG1 | L1 | L2 | L3 | L4 | L5 | This is not / genuine / hardware :( | I2C1 | DA | BIND | S5 | S4 | REG3V3 | 1 BIT / SQUARED | VIN | 3V3 | (C) 2014 | CMP2 | Lisa/M | V2.1 | R3 | LVIN | VS | S7 | S6 | CC-BY-SA | USB | JTAG | GPIO | RC RX | UART3 | S8
bPlace: DRDY | SS | SCK | MISO | MOSI | 3V3 | GND | RX | TX | VCC | GND | UART2 | SDA | SCL | 3V3 | GND | I2C2 | S1 | SPI1 | CMP1 | I2C1CAN | S2 | S3 | Lisa/M | R3 | v2.1 | 2014 | (C)1B2 | S4 | S5 | USB | S6 | S7 | RX | 3V3 | GND | VCC | TX | RX | USB | GND | 3V3 | PC12 | TRST | USB | RC | V_IN | GPIO | GND | 3V3 | RX1 | GND | 3V3 | RX5 | UART3 | GND | D+ | D- | UBUS | S8
tNames: JTAG | CON_USB_MICRO
bNames: Q1
Reference: (C) 2010-2015 Piotr Esden-Tempski <piotr@esden.net> | Licensed under: | CC-BY-SA 3.0 | http://creativecommons.org/licenses/by-sa/3.0/
tDocu: SOT23-5 / 5V | SO8 3V3 | D3 SHOT | JTAG
bDocu: SOT23-5 / 3V3